# EAGLE design aiba (EAGLE 5.10)

## Sheet 1 of 7
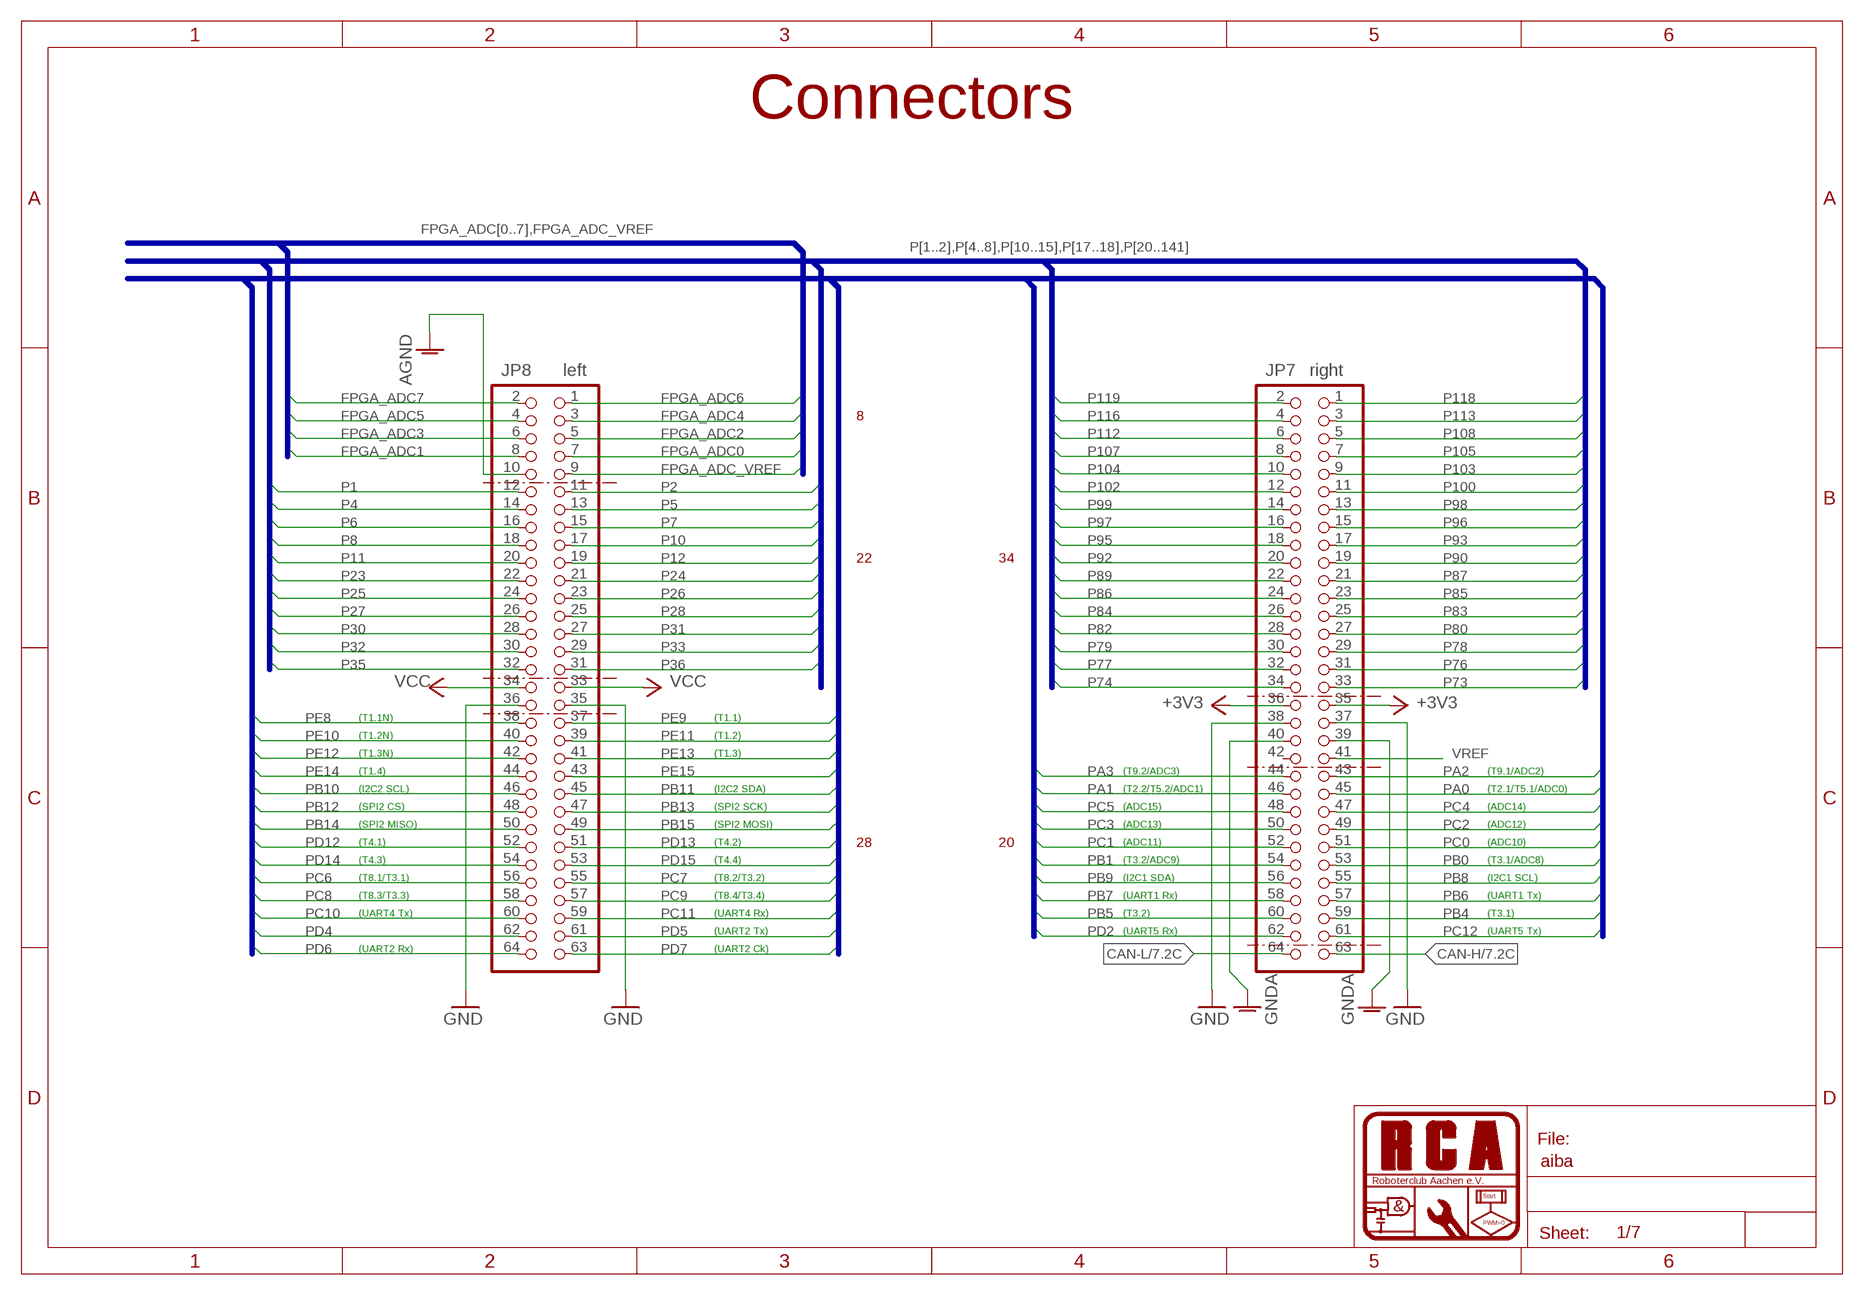
[diagram p0: schematic, sheet 1]

### Parts
JP7  right  PINHD-2X32_2.00-SMD  [2X32M_SMD]
JP8  left  PINHD-2X32_2.00-SMD  [2X32M_SMD]

### Nets
+3V3: JP7.35 JP7.36 ; also sheet 2,4,5,6,7
AGND: JP8.10
CAN-H: JP7.63 ; also sheet 7
CAN-L: JP7.64 ; also sheet 7
FPGA_ADC0: JP8.7
FPGA_ADC1: JP8.8
FPGA_ADC2: JP8.5
FPGA_ADC3: JP8.6
FPGA_ADC4: JP8.3
FPGA_ADC5: JP8.4
FPGA_ADC6: JP8.1
FPGA_ADC7: JP8.2
FPGA_ADC_VREF: JP8.9
GND: JP7.37 JP7.38 JP8.35 JP8.36 ; also sheet 2,3,4,5,6,7
GNDA: JP7.39 JP7.40 ; also sheet 6
P1: JP8.12 ; also sheet 2
P2: JP8.11 ; also sheet 2
P4: JP8.14 ; also sheet 2
P5: JP8.13 ; also sheet 2
P6: JP8.16 ; also sheet 2
P7: JP8.15 ; also sheet 2
P8: JP8.18 ; also sheet 2
P10: JP8.17 ; also sheet 2
P11: JP8.20 ; also sheet 2
P12: JP8.19 ; also sheet 2
P23: JP8.22 ; also sheet 2
P24: JP8.21 ; also sheet 2
P25: JP8.24 ; also sheet 2
P26: JP8.23 ; also sheet 2
P27: JP8.26 ; also sheet 2
P28: JP8.25 ; also sheet 2
P30: JP8.28 ; also sheet 2
P31: JP8.27 ; also sheet 2
P32: JP8.30 ; also sheet 2
P33: JP8.29 ; also sheet 2
P35: JP8.32 ; also sheet 2
P36: JP8.31 ; also sheet 2
P73: JP7.33 ; also sheet 2
P74: JP7.34 ; also sheet 2
P76: JP7.31 ; also sheet 2
P77: JP7.32 ; also sheet 2
P78: JP7.29 ; also sheet 2
P79: JP7.30 ; also sheet 2
P80: JP7.27 ; also sheet 2
P82: JP7.28 ; also sheet 2
P83: JP7.25 ; also sheet 2
P84: JP7.26 ; also sheet 2
P85: JP7.23 ; also sheet 2
P86: JP7.24 ; also sheet 2
P87: JP7.21 ; also sheet 2
P89: JP7.22 ; also sheet 2
P90: JP7.19 ; also sheet 2
P92: JP7.20 ; also sheet 2
P93: JP7.17 ; also sheet 2
P95: JP7.18 ; also sheet 2
P96: JP7.15 ; also sheet 2
P97: JP7.16 ; also sheet 2
P98: JP7.13 ; also sheet 2
P99: JP7.14 ; also sheet 2
P100: JP7.11 ; also sheet 2
P102: JP7.12 ; also sheet 2
P103: JP7.9 ; also sheet 2
P104: JP7.10 ; also sheet 2
P105: JP7.7 ; also sheet 2
P107: JP7.8 ; also sheet 2
P108: JP7.5 ; also sheet 2
P112: JP7.6 ; also sheet 2
P113: JP7.3 ; also sheet 2
P116: JP7.4 ; also sheet 2
P118: JP7.1 ; also sheet 2
P119: JP7.2 ; also sheet 2
PA0: JP7.45 ; also sheet 5
PA1: JP7.46 ; also sheet 5
PA2: JP7.43 ; also sheet 5
PA3: JP7.44 ; also sheet 5
PB0: JP7.53 ; also sheet 5
PB1: JP7.54 ; also sheet 5
PB4: JP7.59 ; also sheet 5
PB5: JP7.60 ; also sheet 5
PB6: JP7.57 ; also sheet 5
PB7: JP7.58 ; also sheet 5
PB8: JP7.55 ; also sheet 5
PB9: JP7.56 ; also sheet 5
PB10: JP8.46 ; also sheet 5
PB11: JP8.45 ; also sheet 5
PB12: JP8.48 ; also sheet 5
PB13: JP8.47 ; also sheet 5
PB14: JP8.50 ; also sheet 5
PB15: JP8.49 ; also sheet 5
PC0: JP7.51 ; also sheet 5
PC1: JP7.52 ; also sheet 5
PC2: JP7.49 ; also sheet 5
PC3: JP7.50 ; also sheet 5
PC4: JP7.47 ; also sheet 5
PC5: JP7.48 ; also sheet 5
PC6: JP8.56 ; also sheet 5
PC7: JP8.55 ; also sheet 5
PC8: JP8.58 ; also sheet 5
PC9: JP8.57 ; also sheet 5
PC10: JP8.60 ; also sheet 5
PC11: JP8.59 ; also sheet 5
PC12: JP7.61 ; also sheet 5
PD2: JP7.62 ; also sheet 5
PD4: JP8.62 ; also sheet 5
PD5: JP8.61 ; also sheet 5
PD6: JP8.64 ; also sheet 5
PD7: JP8.63 ; also sheet 5
PD12: JP8.52 ; also sheet 5
PD13: JP8.51 ; also sheet 5
PD14: JP8.54 ; also sheet 5
PD15: JP8.53 ; also sheet 5
PE8: JP8.38 ; also sheet 5
PE9: JP8.37 ; also sheet 5
PE10: JP8.40 ; also sheet 5
PE11: JP8.39 ; also sheet 5
PE12: JP8.42 ; also sheet 5
PE13: JP8.41 ; also sheet 5
PE14: JP8.44 ; also sheet 5
PE15: JP8.43 ; also sheet 5
VCC: JP8.33 JP8.34 ; also sheet 4
VREF: JP7.41 ; also sheet 6
Unconnected: JP7.42

### Buses
FPGA_ADC[0..7],FPGA_ADC_VREF
P[1..2],P[4..8],P[10..15],P[17..18],P[20..141]
PA[0..3],PA8,PB[0..2],PB[4..15],PC[0..12],PC14,FLASH_CS,PD2,SD_CS,PD[4..7],PD[12..15],PE[0..15]

### Notes on the sheet
- Connectors
- 8
- 22 | 34
- (T1.1N) | (T1.1)
- (T1.2N) | (T1.2)
- (T1.3N) | (T1.3)
- (T1.4) | (T9.2/ADC3) | (T9.1/ADC2)
- (I2C2 SCL) | (I2C2 SDA) | (T2.2/T5.2/ADC1) | (T2.1/T5.1/ADC0)
- (SPI2 CS) | (SPI2 SCK) | (ADC15) | (ADC14)
- (SPI2 MISO) | (SPI2 MOSI) | (ADC13) | (ADC12)
- (T4.1) | (T4.2) | 28 | 20 | (ADC11) | (ADC10)
- (T4.3) | (T4.4) | (T3.2/ADC9) | (T3.1/ADC8)
- (T8.1/T3.1) | (T8.2/T3.2) | (I2C1 SDA) | (I2C1 SCL)
- (T8.3/T3.3) | (T8.4/T3.4) | (UART1 Rx) | (UART1 Tx)
- (UART4 Tx) | (UART4 Rx) | (T3.2) | (T3.1)
- (UART2 Tx) | (UART5 Rx) | (UART5 Tx)
- (UART2 Rx) | (UART2 Ck)

## Sheet 2 of 7
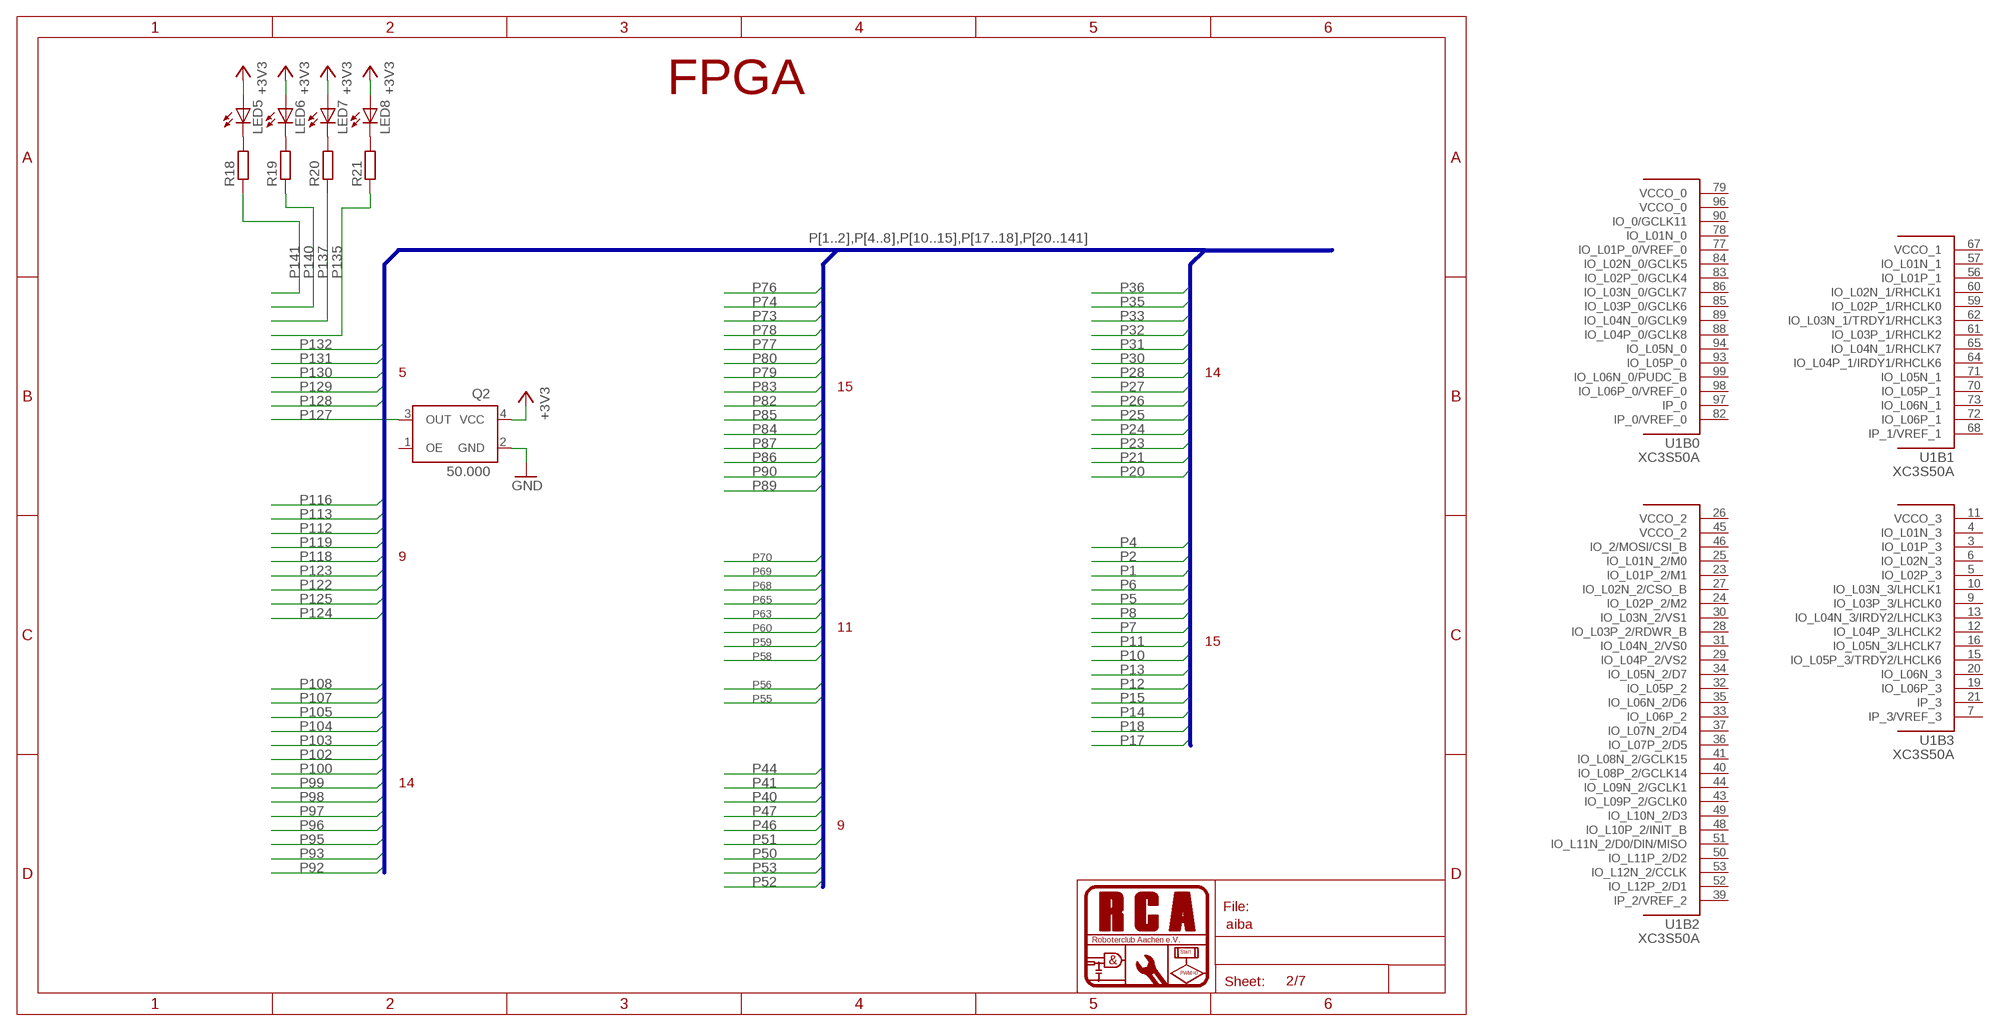
[diagram p1: schematic, sheet 2]

### Parts
LED5  LEDCHIPLED_0805  [CHIPLED_0805]
LED6  LEDCHIPLED_0805  [CHIPLED_0805]
LED7  LEDCHIPLED_0805  [CHIPLED_0805]
LED8  LEDCHIPLED_0805  [CHIPLED_0805]
Q2  50.000  XO53  [XO53]
R18  R-EU_R0805  [R0805]
R19  R-EU_R0805  [R0805]
R20  R-EU_R0805  [R0805]
R21  R-EU_R0805  [R0805]
U1  XC3S50A  XC3S50AVQ100  [VQ100]

### Nets
+3V3: LED5.A LED6.A LED7.A LED8.A Q2.4(VCC) ; also sheet 1,4,5,6,7
GND: Q2.2(GND) ; also sheet 1,3,4,5,6,7
N$22: LED8.C R21.2
N$23: LED7.C R20.2
N$24: LED6.C R19.2
N$25: LED5.C R18.2
P127: Q2.3(OUT)
P135: R21.1
P137: R20.1
P140: R19.1
P141: R18.1
Unconnected: Q2.1(OE) U1.3(B3:IO_L01P_3) U1.4(B3:IO_L01N_3) U1.5(B3:IO_L02P_3) U1.6(B3:IO_L02N_3) U1.7(B3:IP_3/VREF_3) U1.9(B3:IO_L03P_3/LHCLK0) U1.10(B3:IO_L03N_3/LHCLK1) U1.11(B3:VCCO_3) U1.12(B3:IO_L04P_3/LHCLK2) U1.13(B3:IO_L04N_3/IRDY2/LHCLK3) U1.15(B3:IO_L05P_3/TRDY2/LHCLK6) U1.16(B3:IO_L05N_3/LHCLK7) U1.19(B3:IO_L06P_3) U1.20(B3:IO_L06N_3) U1.21(B3:IP_3) U1.23(B2:IO_L01P_2/M1) U1.24(B2:IO_L02P_2/M2) U1.25(B2:IO_L01N_2/M0) U1.26(B2:VCCO_2) U1.27(B2:IO_L02N_2/CSO_B) U1.28(B2:IO_L03P_2/RDWR_B) U1.29(B2:IO_L04P_2/VS2) U1.30(B2:IO_L03N_2/VS1) U1.31(B2:IO_L04N_2/VS0) U1.32(B2:IO_L05P_2) U1.33(B2:IO_L06P_2) U1.34(B2:IO_L05N_2/D7) U1.35(B2:IO_L06N_2/D6) U1.36(B2:IO_L07P_2/D5) U1.37(B2:IO_L07N_2/D4) U1.39(B2:IP_2/VREF_2) U1.40(B2:IO_L08P_2/GCLK14) U1.41(B2:IO_L08N_2/GCLK15) U1.43(B2:IO_L09P_2/GCLK0) U1.44(B2:IO_L09N_2/GCLK1) U1.45(B2:VCCO_2) U1.46(B2:IO_2/MOSI/CSI_B) U1.48(B2:IO_L10P_2/INIT_B) U1.49(B2:IO_L10N_2/D3) U1.50(B2:IO_L11P_2/D2) U1.51(B2:IO_L11N_2/D0/DIN/MISO) U1.52(B2:IO_L12P_2/D1) U1.53(B2:IO_L12N_2/CCLK) U1.56(B1:IO_L01P_1) U1.57(B1:IO_L01N_1) U1.59(B1:IO_L02P_1/RHCLK0) U1.60(B1:IO_L02N_1/RHCLK1) U1.61(B1:IO_L03P_1/RHCLK2) U1.62(B1:IO_L03N_1/TRDY1/RHCLK3) U1.64(B1:IO_L04P_1/IRDY1/RHCLK6) U1.65(B1:IO_L04N_1/RHCLK7) U1.67(B1:VCCO_1) U1.68(B1:IP_1/VREF_1) U1.70(B1:IO_L05P_1) U1.71(B1:IO_L05N_1) U1.72(B1:IO_L06P_1) U1.73(B1:IO_L06N_1) U1.77(B0:IO_L01P_0/VREF_0) U1.78(B0:IO_L01N_0) U1.79(B0:VCCO_0) U1.82(B0:IP_0/VREF_0) U1.83(B0:IO_L02P_0/GCLK4) U1.84(B0:IO_L02N_0/GCLK5) U1.85(B0:IO_L03P_0/GCLK6) U1.86(B0:IO_L03N_0/GCLK7) U1.88(B0:IO_L04P_0/GCLK8) U1.89(B0:IO_L04N_0/GCLK9) U1.90(B0:IO_0/GCLK11) U1.93(B0:IO_L05P_0) U1.94(B0:IO_L05N_0) U1.96(B0:VCCO_0) U1.97(B0:IP_0) U1.98(B0:IO_L06P_0/VREF_0) U1.99(B0:IO_L06N_0/PUDC_B)

### Buses
P[1..2],P[4..8],P[10..15],P[17..18],P[20..141]

### Notes on the sheet
- FPGA
- 5 | 14
- 15
- 9
- 11
- 15
- 14
- 9

## Sheet 3 of 7
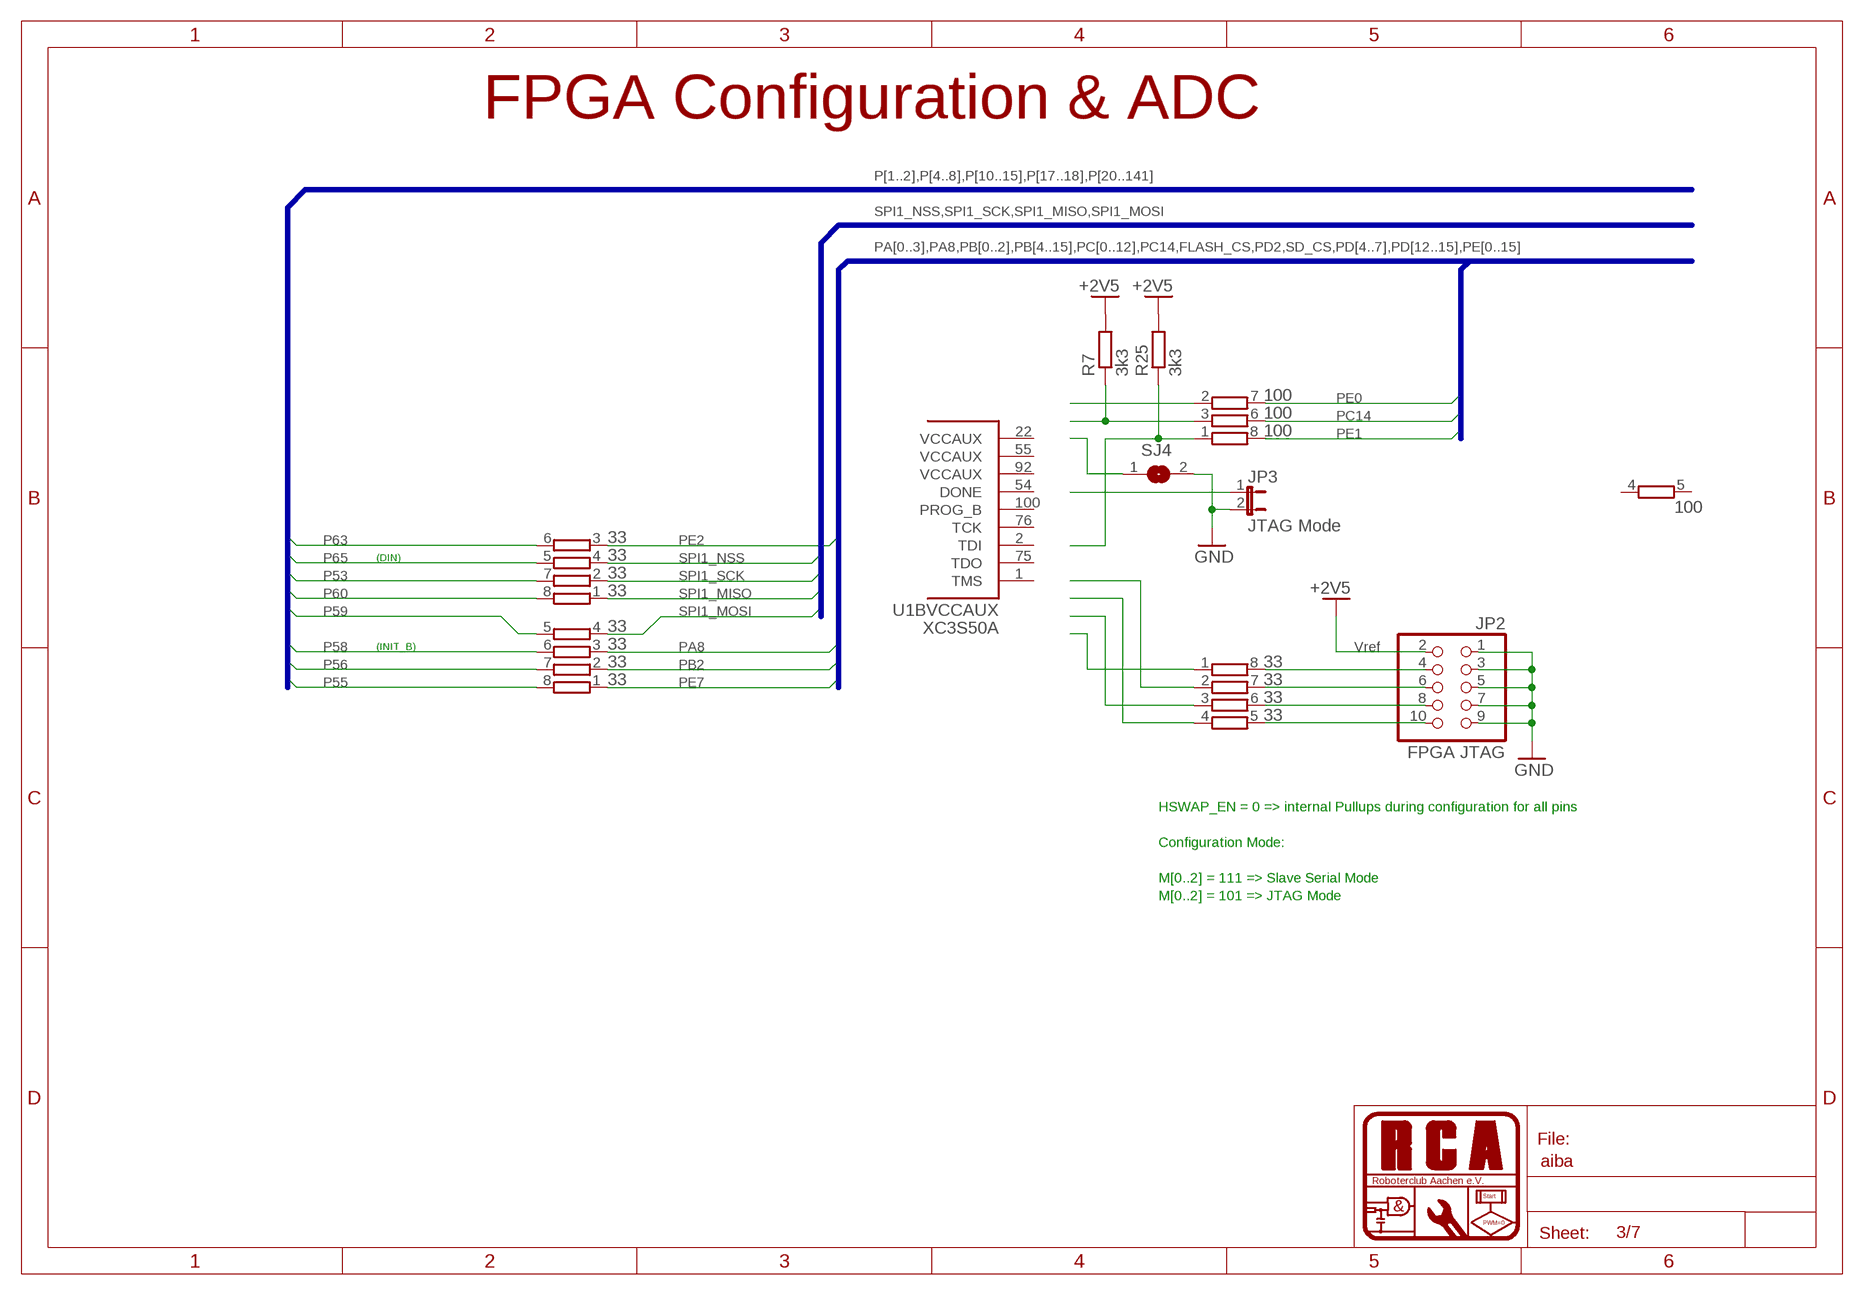
[diagram p2: schematic, sheet 3]

### Parts
JP2  FPGA JTAG  PINHD-2X5_2.54-SMD  [2X05SMD]
JP3  JTAG Mode  JP1E  [JP1]
R7  3k3  R-EU_R0805  [R0805]
R25  3k3  R-EU_R0805  [R0805]
RN1  33  4R-NEXB38V  [EXB38V]
RN2  33  4R-NEXB38V  [EXB38V]
RN3  33  4R-NEXB38V  [EXB38V]
RN4  100  4R-NEXB38V  [EXB38V]
SJ4  SJ  [SJ]

### Nets
+2V5: JP2.2 R7.2 R25.2 ; also sheet 4
GND: JP2.1 JP2.3 JP2.5 JP2.7 JP2.9 JP3.2 SJ4.2 ; also sheet 1,2,4,5,6,7
N$2: R25.1 RN4.1
N$3: R7.1 RN4.3
N$5: JP3.1
N$6: SJ4.1
N$7: RN4.2
N$8: RN3.2
N$9: RN3.4
N$10: RN3.3
N$11: RN3.1
N$12: JP2.6 RN3.7
N$13: JP2.8 RN3.6
N$14: JP2.10 RN3.5
N$15: JP2.4 RN3.8
P53: RN1.7 ; also sheet 2
P55: RN2.8 ; also sheet 2
P56: RN2.7 ; also sheet 2
P58: RN2.6 ; also sheet 2
P59: RN2.5 ; also sheet 2
P60: RN1.8 ; also sheet 2
P63: RN1.6 ; also sheet 2
P65: RN1.5 ; also sheet 2
PA8: RN2.3 ; also sheet 5
PB2: RN2.2 ; also sheet 5
PC14: RN4.6 ; also sheet 5
PE0: RN4.7 ; also sheet 5
PE1: RN4.8 ; also sheet 5
PE2: RN1.3 ; also sheet 5
PE7: RN2.1 ; also sheet 5
SPI1_MISO: RN1.1 ; also sheet 5
SPI1_MOSI: RN2.4 ; also sheet 5
SPI1_NSS: RN1.4 ; also sheet 5
SPI1_SCK: RN1.2 ; also sheet 5
Unconnected: RN4.4 RN4.5 U1.1(BVCCAUX:TMS) U1.2(BVCCAUX:TDI) U1.22(BVCCAUX:VCCAUX) U1.54(BVCCAUX:DONE) U1.55(BVCCAUX:VCCAUX) U1.75(BVCCAUX:TDO) U1.76(BVCCAUX:TCK) U1.92(BVCCAUX:VCCAUX) U1.100(BVCCAUX:PROG_B)

### Buses
P[1..2],P[4..8],P[10..15],P[17..18],P[20..141]
SPI1_NSS,SPI1_SCK,SPI1_MISO,SPI1_MOSI
PA[0..3],PA8,PB[0..2],PB[4..15],PC[0..12],PC14,FLASH_CS,PD2,SD_CS,PD[4..7],PD[12..15],PE[0..15]

### Notes on the sheet
- FPGA Configuration & ADC
- (DIN)
- (INIT_B) | Vref
- HSWAP_EN = 0 => internal Pullups during configuration for all pins
- Configuration Mode:
- M[0..2] = 111 => Slave Serial Mode
- M[0..2] = 101 => JTAG Mode

## Sheet 4 of 7
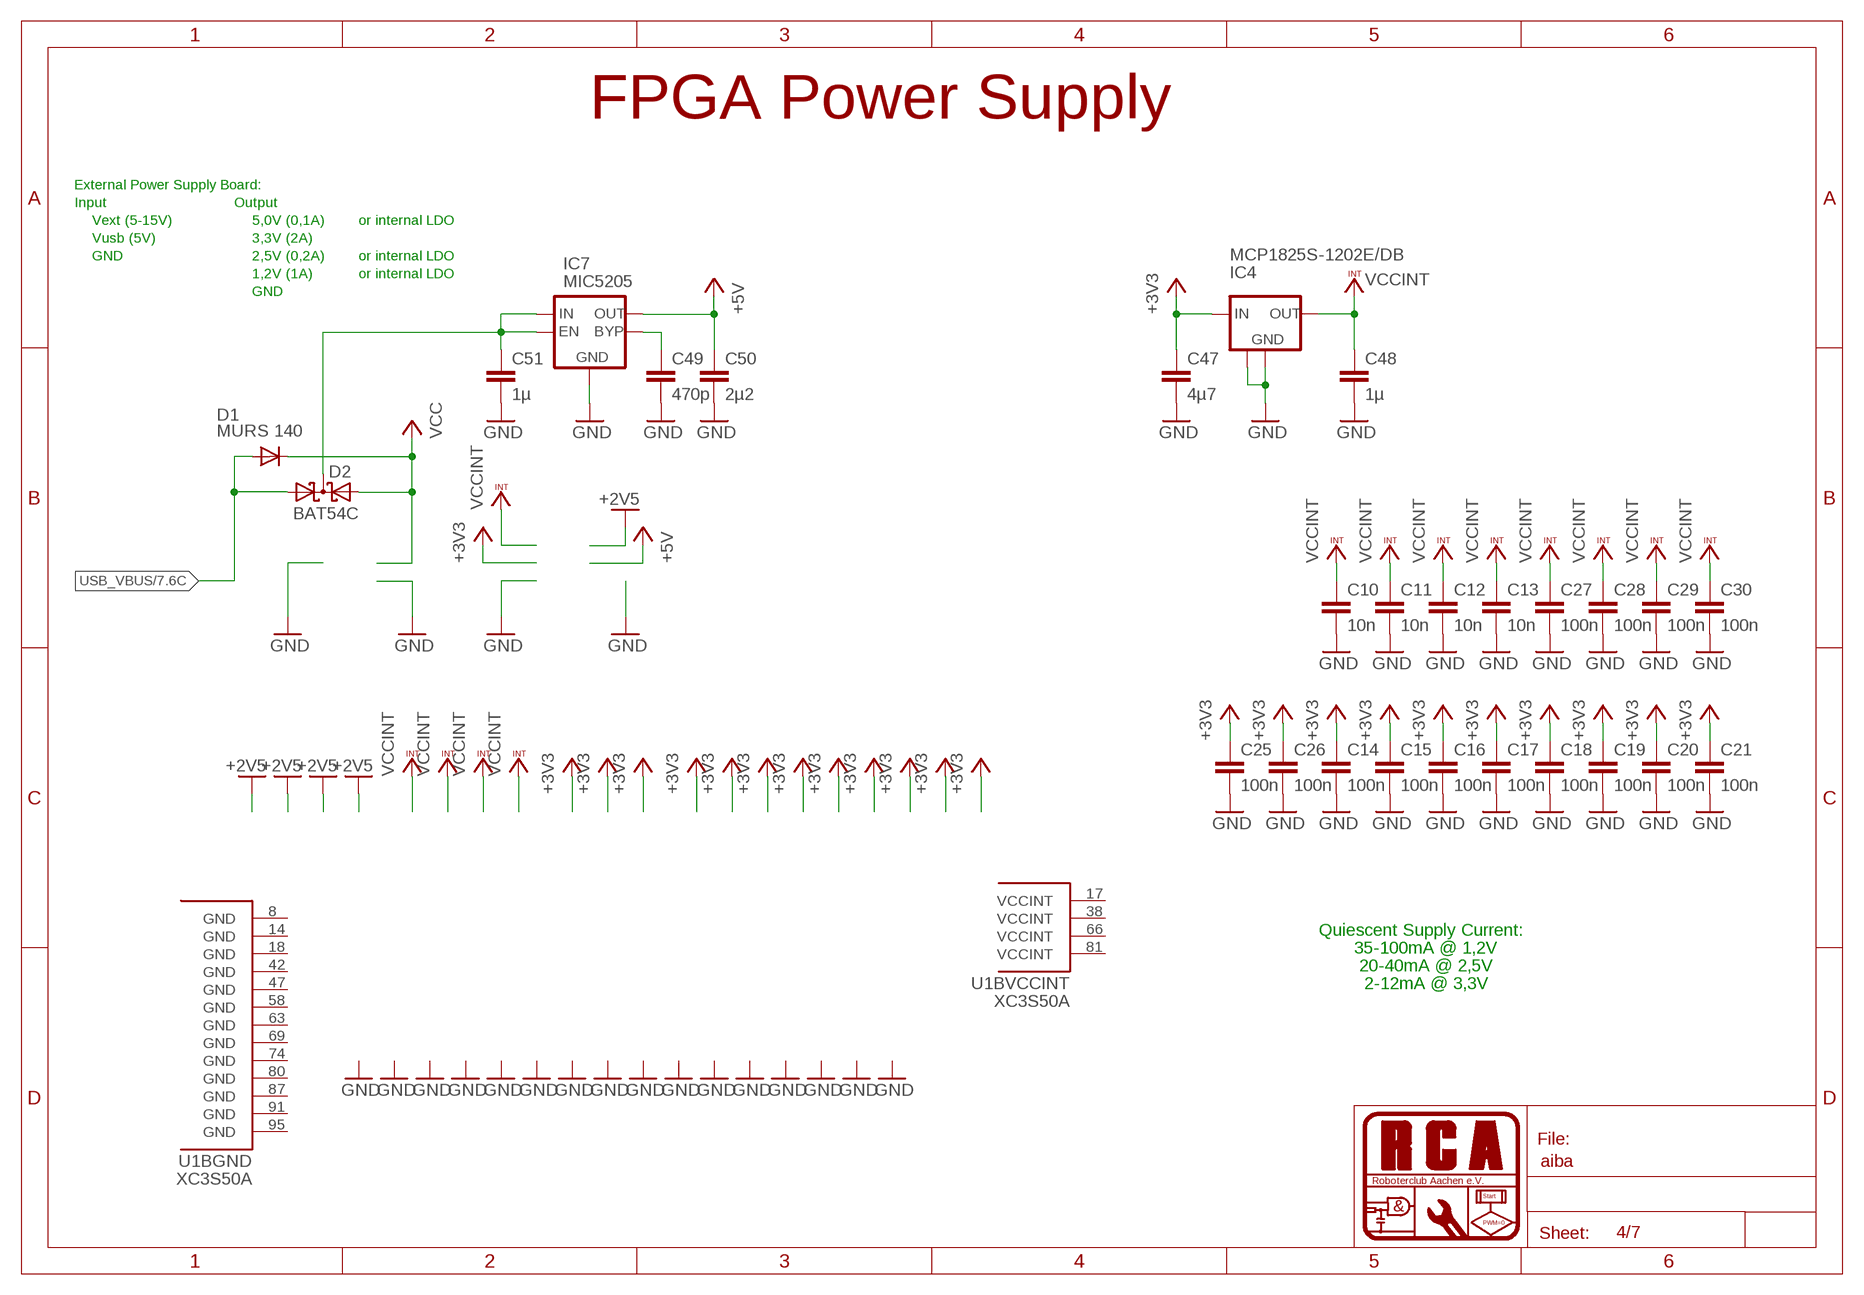
[diagram p3: schematic, sheet 4]

### Parts
C10  10n  C-EUC0603  [C0603]
C11  10n  C-EUC0603  [C0603]
C12  10n  C-EUC0603  [C0603]
C13  10n  C-EUC0603  [C0603]
C14  100n  C-EUC0603  [C0603]
C15  100n  C-EUC0603  [C0603]
C16  100n  C-EUC0603  [C0603]
C17  100n  C-EUC0603  [C0603]
C18  100n  C-EUC0603  [C0603]
C19  100n  C-EUC0603  [C0603]
C20  100n  C-EUC0603  [C0603]
C21  100n  C-EUC0603  [C0603]
C25  100n  C-EUC0603  [C0603]
C26  100n  C-EUC0603  [C0603]
C27  100n  C-EUC0603  [C0603]
C28  100n  C-EUC0603  [C0603]
C29  100n  C-EUC0603  [C0603]
C30  100n  C-EUC0603  [C0603]
C47  4µ7  C-EUC0805  [C0805]
C48  1µ  C-EUC0805  [C0805]
C49  470p  C-EUC0805  [C0805]
C50  2µ2  C-EUC0805  [C0805]
C51  1µ  C-EUC0805  [C0805]
D1  MURS 140  DIODE-SMB  [SMB]
D2  BAT54C  [SOT23]
IC4  MCP1825S-1202E/DB  MCP1825DB  [SOT223]
IC7  MIC5205  [SOT23-5L]

### Nets
+3V3: C14.1 C15.1 C16.1 C17.1 C18.1 C19.1 C20.1 C21.1 C25.1 C26.1 C47.1 IC4.1(IN) ; also sheet 1,2,5,6,7
+5V: C50.1 IC7.5(OUT) ; also sheet 7
GND: C10.2 C11.2 C12.2 C13.2 C14.2 C15.2 C16.2 C17.2 C18.2 C19.2 C20.2 C21.2 C25.2 C26.2 C27.2 C28.2 C29.2 C30.2 C47.2 C48.2 C49.2 C50.2 C51.2 IC4.2(GND) IC4.4(GND) IC7.2(GND) ; also sheet 1,2,3,5,6,7
N$40: C49.1 IC7.4(BYP)
N$43: C51.1 D2.3(CC) IC7.1(IN) IC7.3(EN)
USB_VBUS: D1.A D2.1(A1) ; also sheet 5,7
VCC: D1.C D2.2(A2) ; also sheet 1
VCCINT: C10.1 C11.1 C12.1 C13.1 C27.1 C28.1 C29.1 C30.1 C48.1 IC4.3(OUT)
Unconnected: U1.17(BVCCINT:VCCINT) U1.38(BVCCINT:VCCINT) U1.66(BVCCINT:VCCINT) U1.81(BVCCINT:VCCINT)

### Notes on the sheet
- FPGA Power Supply
- External Power Supply Board:
- Input | Output
- Vext (5-15V) | 5,0V (0,1A) | or internal LDO
- Vusb (5V) | 3,3V (2A)
- GND | 2,5V (0,2A) | or internal LDO
- 1,2V (1A) | or internal LDO
- GND
- Quiescent Supply Current:
- 35-100mA @ 1,2V
- 20-40mA @ 2,5V
- 2-12mA @ 3,3V

## Sheet 5 of 7
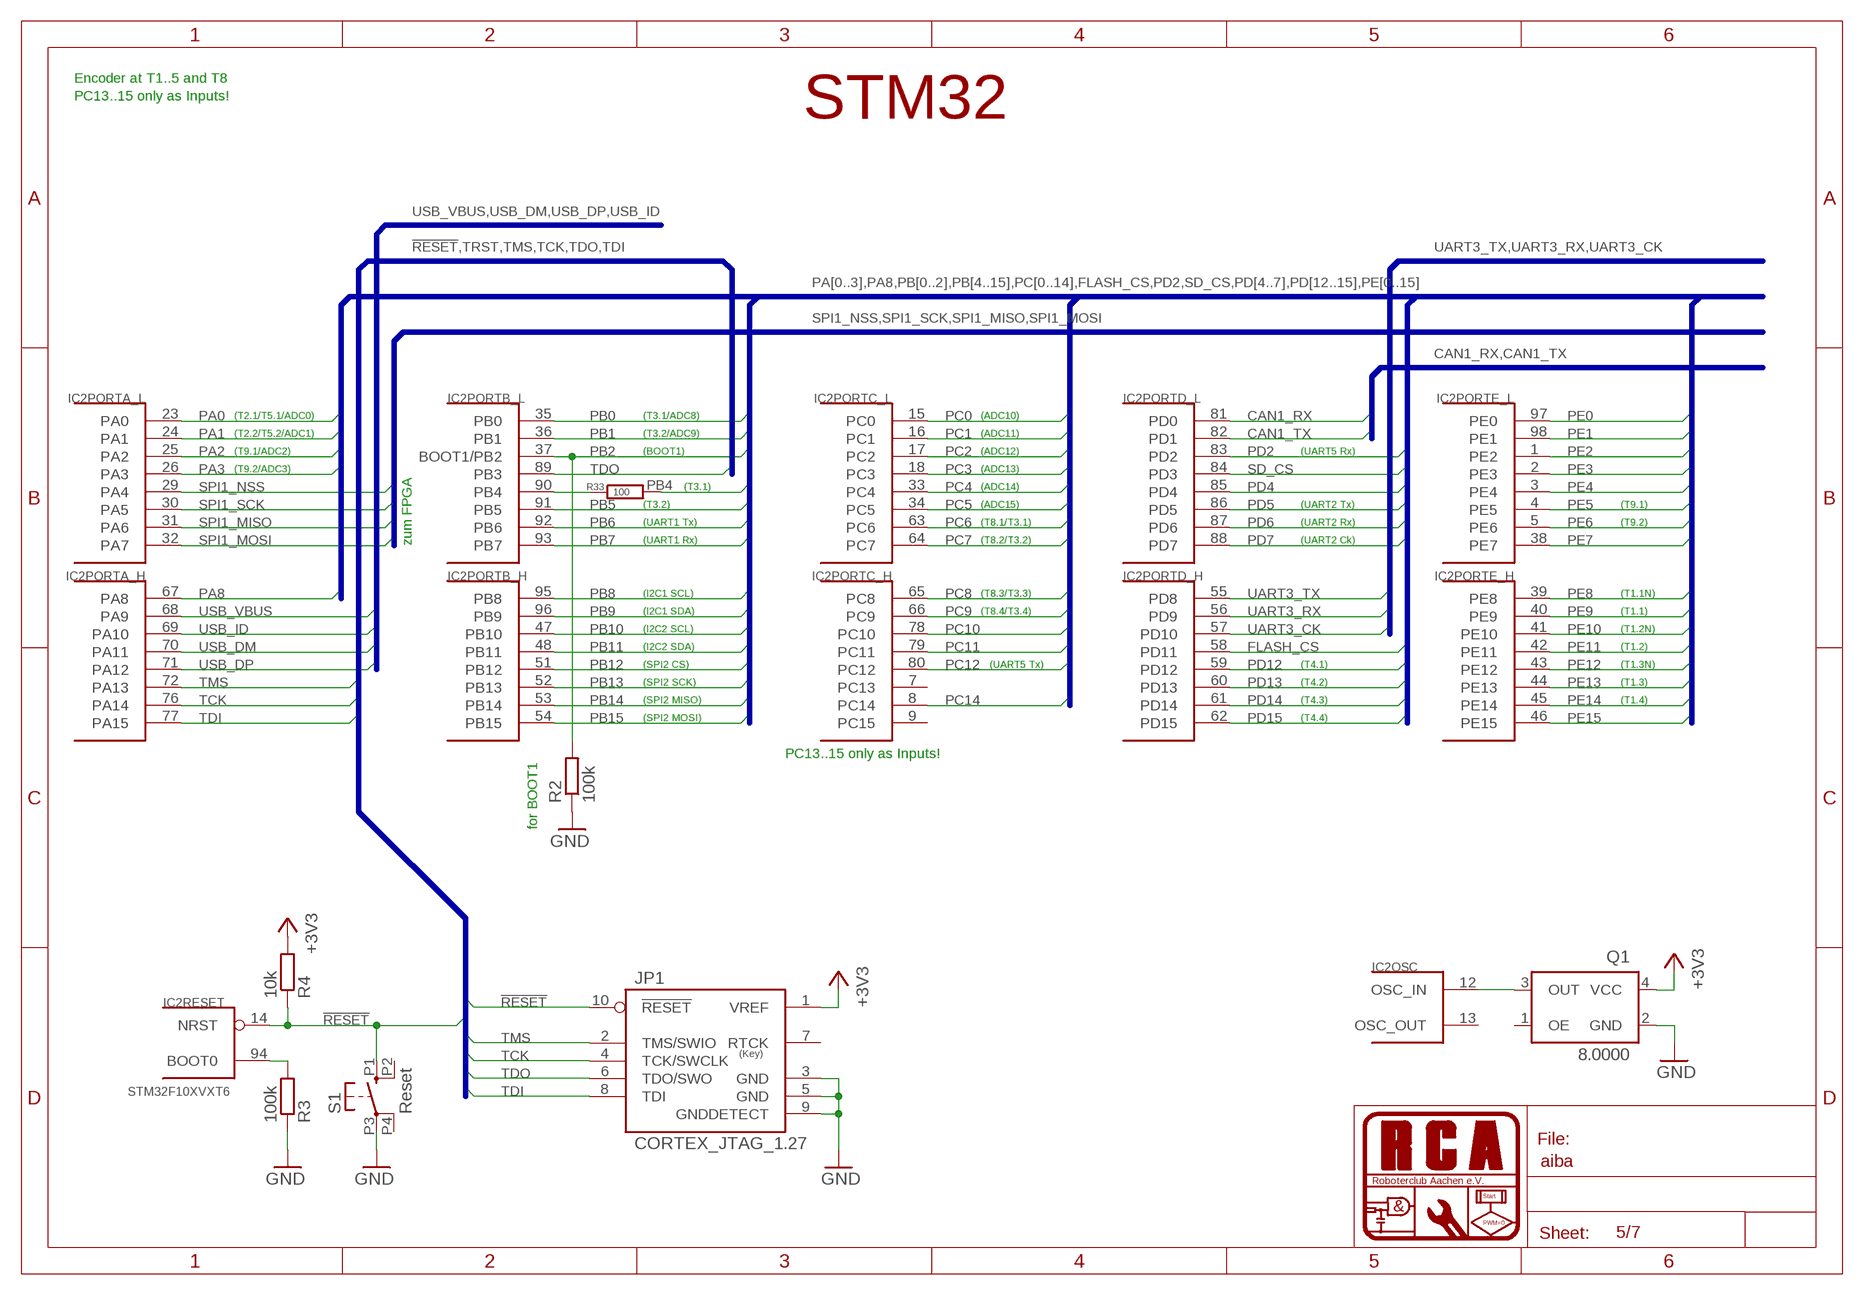
[diagram p4: schematic, sheet 5]

### Parts
IC2  STM32F10XVXT6  [TQFP100]
JP1  CORTEX_JTAG_1.27  [1365-10]
Q1  8.0000  XO53  [XO53]
R2  100k  R-EU_R0805  [R0805]
R3  100k  R-EU_R0805  [R0805]
R4  10k  R-EU_R0805  [R0805]
R33  100  R-EU_R0805  [R0805]
S1  Reset  10-XXLSH  [B3F-10XX-SMD]

### Nets
!RESET: IC2.14(RESET:NRST) JP1.10(!RESET) R4.1 S1.P1(S)
+3V3: JP1.1(VREF) Q1.4(VCC) R4.2 ; also sheet 1,2,4,6,7
CAN1_RX: IC2.81(PORTD_L:PD0) ; also sheet 7
CAN1_TX: IC2.82(PORTD_L:PD1) ; also sheet 7
FLASH_CS: IC2.58(PORTD_H:PD11) ; also sheet 7
GND: JP1.3(GND) JP1.5(GND) JP1.9(GNDDETECT) Q1.2(GND) R2.1 R3.1 S1.P3(P) ; also sheet 1,2,3,4,6,7
N$1: IC2.12(OSC:OSC_IN) Q1.3(OUT)
N$4: IC2.94(RESET:BOOT0) R3.2
N$34: IC2.90(PORTB_L:PB4) R33.1
PA0: IC2.23(PORTA_L:PA0) ; also sheet 1
PA1: IC2.24(PORTA_L:PA1) ; also sheet 1
PA2: IC2.25(PORTA_L:PA2) ; also sheet 1
PA3: IC2.26(PORTA_L:PA3) ; also sheet 1
PA8: IC2.67(PORTA_H:PA8) ; also sheet 3
PB0: IC2.35(PORTB_L:PB0) ; also sheet 1
PB1: IC2.36(PORTB_L:PB1) ; also sheet 1
PB2: IC2.37(PORTB_L:BOOT1/PB2) R2.2 ; also sheet 3
PB4: R33.2 ; also sheet 1
PB5: IC2.91(PORTB_L:PB5) ; also sheet 1
PB6: IC2.92(PORTB_L:PB6) ; also sheet 1
PB7: IC2.93(PORTB_L:PB7) ; also sheet 1
PB8: IC2.95(PORTB_H:PB8) ; also sheet 1
PB9: IC2.96(PORTB_H:PB9) ; also sheet 1
PB10: IC2.47(PORTB_H:PB10) ; also sheet 1
PB11: IC2.48(PORTB_H:PB11) ; also sheet 1
PB12: IC2.51(PORTB_H:PB12) ; also sheet 1
PB13: IC2.52(PORTB_H:PB13) ; also sheet 1
PB14: IC2.53(PORTB_H:PB14) ; also sheet 1
PB15: IC2.54(PORTB_H:PB15) ; also sheet 1
PC0: IC2.15(PORTC_L:PC0) ; also sheet 1
PC1: IC2.16(PORTC_L:PC1) ; also sheet 1
PC2: IC2.17(PORTC_L:PC2) ; also sheet 1
PC3: IC2.18(PORTC_L:PC3) ; also sheet 1
PC4: IC2.33(PORTC_L:PC4) ; also sheet 1
PC5: IC2.34(PORTC_L:PC5) ; also sheet 1
PC6: IC2.63(PORTC_L:PC6) ; also sheet 1
PC7: IC2.64(PORTC_L:PC7) ; also sheet 1
PC8: IC2.65(PORTC_H:PC8) ; also sheet 1
PC9: IC2.66(PORTC_H:PC9) ; also sheet 1
PC10: IC2.78(PORTC_H:PC10) ; also sheet 1
PC11: IC2.79(PORTC_H:PC11) ; also sheet 1
PC12: IC2.80(PORTC_H:PC12) ; also sheet 1
PC14: IC2.8(PORTC_H:PC14) ; also sheet 3
PD2: IC2.83(PORTD_L:PD2) ; also sheet 1
PD4: IC2.85(PORTD_L:PD4) ; also sheet 1
PD5: IC2.86(PORTD_L:PD5) ; also sheet 1
PD6: IC2.87(PORTD_L:PD6) ; also sheet 1
PD7: IC2.88(PORTD_L:PD7) ; also sheet 1
PD12: IC2.59(PORTD_H:PD12) ; also sheet 1
PD13: IC2.60(PORTD_H:PD13) ; also sheet 1
PD14: IC2.61(PORTD_H:PD14) ; also sheet 1
PD15: IC2.62(PORTD_H:PD15) ; also sheet 1
PE0: IC2.97(PORTE_L:PE0) ; also sheet 3
PE1: IC2.98(PORTE_L:PE1) ; also sheet 3
PE2: IC2.1(PORTE_L:PE2) ; also sheet 3
PE3: IC2.2(PORTE_L:PE3) ; also sheet 7
PE4: IC2.3(PORTE_L:PE4) ; also sheet 7
PE5: IC2.4(PORTE_L:PE5) ; also sheet 7
PE6: IC2.5(PORTE_L:PE6) ; also sheet 7
PE7: IC2.38(PORTE_L:PE7) ; also sheet 3
PE8: IC2.39(PORTE_H:PE8) ; also sheet 1
PE9: IC2.40(PORTE_H:PE9) ; also sheet 1
PE10: IC2.41(PORTE_H:PE10) ; also sheet 1
PE11: IC2.42(PORTE_H:PE11) ; also sheet 1
PE12: IC2.43(PORTE_H:PE12) ; also sheet 1
PE13: IC2.44(PORTE_H:PE13) ; also sheet 1
PE14: IC2.45(PORTE_H:PE14) ; also sheet 1
PE15: IC2.46(PORTE_H:PE15) ; also sheet 1
SD_CS: IC2.84(PORTD_L:PD3)
SPI1_MISO: IC2.31(PORTA_L:PA6) ; also sheet 3
SPI1_MOSI: IC2.32(PORTA_L:PA7) ; also sheet 3
SPI1_NSS: IC2.29(PORTA_L:PA4) ; also sheet 3
SPI1_SCK: IC2.30(PORTA_L:PA5) ; also sheet 3
TCK: IC2.76(PORTA_H:PA14) JP1.4(TCK/SWCLK)
TDI: IC2.77(PORTA_H:PA15) JP1.8(TDI)
TDO: IC2.89(PORTB_L:PB3) JP1.6(TDO/SWO)
TMS: IC2.72(PORTA_H:PA13) JP1.2(TMS/SWIO)
UART3_CK: IC2.57(PORTD_H:PD10) ; also sheet 7
UART3_RX: IC2.56(PORTD_H:PD9) ; also sheet 7
UART3_TX: IC2.55(PORTD_H:PD8) ; also sheet 7
USB_DM: IC2.70(PORTA_H:PA11) ; also sheet 7
USB_DP: IC2.71(PORTA_H:PA12) ; also sheet 7
USB_ID: IC2.69(PORTA_H:PA10) ; also sheet 7
USB_VBUS: IC2.68(PORTA_H:PA9) ; also sheet 4,7
Unconnected: IC2.7(PORTC_H:PC13) IC2.9(PORTC_H:PC15) IC2.13(OSC:OSC_OUT) JP1.7(RTCK) Q1.1(OE) S1.P2(S1) S1.P4(P1)

### Buses
!RESET,TRST,TMS,TCK,TDO,TDI
USB_VBUS,USB_DM,USB_DP,USB_ID
SPI1_NSS,SPI1_SCK,SPI1_MISO,SPI1_MOSI
CAN1_RX,CAN1_TX
PA[0..3],PA8,PB[0..2],PB[4..15],PC[0..14],FLASH_CS,PD2,SD_CS,PD[4..7],PD[12..15],PE[0..15]
UART3_TX,UART3_RX,UART3_CK

### Notes on the sheet
- Encoder at T1..5 and T8
- PC13..15 only as Inputs!
- STM32
- (T2.1/T5.1/ADC0) | (T3.1/ADC8) | (ADC10)
- (T2.2/T5.2/ADC1) | (T3.2/ADC9) | (ADC11)
- (T9.1/ADC2) | (BOOT1) | (ADC12) | (UART5 Rx)
- (T9.2/ADC3) | (ADC13)
- (T3.1) | (ADC14)
- (T3.2) | (ADC15) | (UART2 Tx) | (T9.1)
- (UART1 Tx) | (T8.1/T3.1) | (UART2 Rx) | (T9.2)
- zum FPGA | (UART1 Rx) | (T8.2/T3.2) | (UART2 Ck)
- (I2C1 SCL) | (T8.3/T3.3) | (T1.1N)
- (I2C1 SDA) | (T8.4/T3.4) | (T1.1)
- (I2C2 SCL) | (T1.2N)
- (I2C2 SDA) | (T1.2)
- (SPI2 CS) | (UART5 Tx) | (T4.1) | (T1.3N)
- (SPI2 SCK) | (T4.2) | (T1.3)
- (SPI2 MISO) | (T4.3) | (T1.4)
- (SPI2 MOSI) | (T4.4)
- PC13..15 only as Inputs!
- for BOOT1

## Sheet 6 of 7
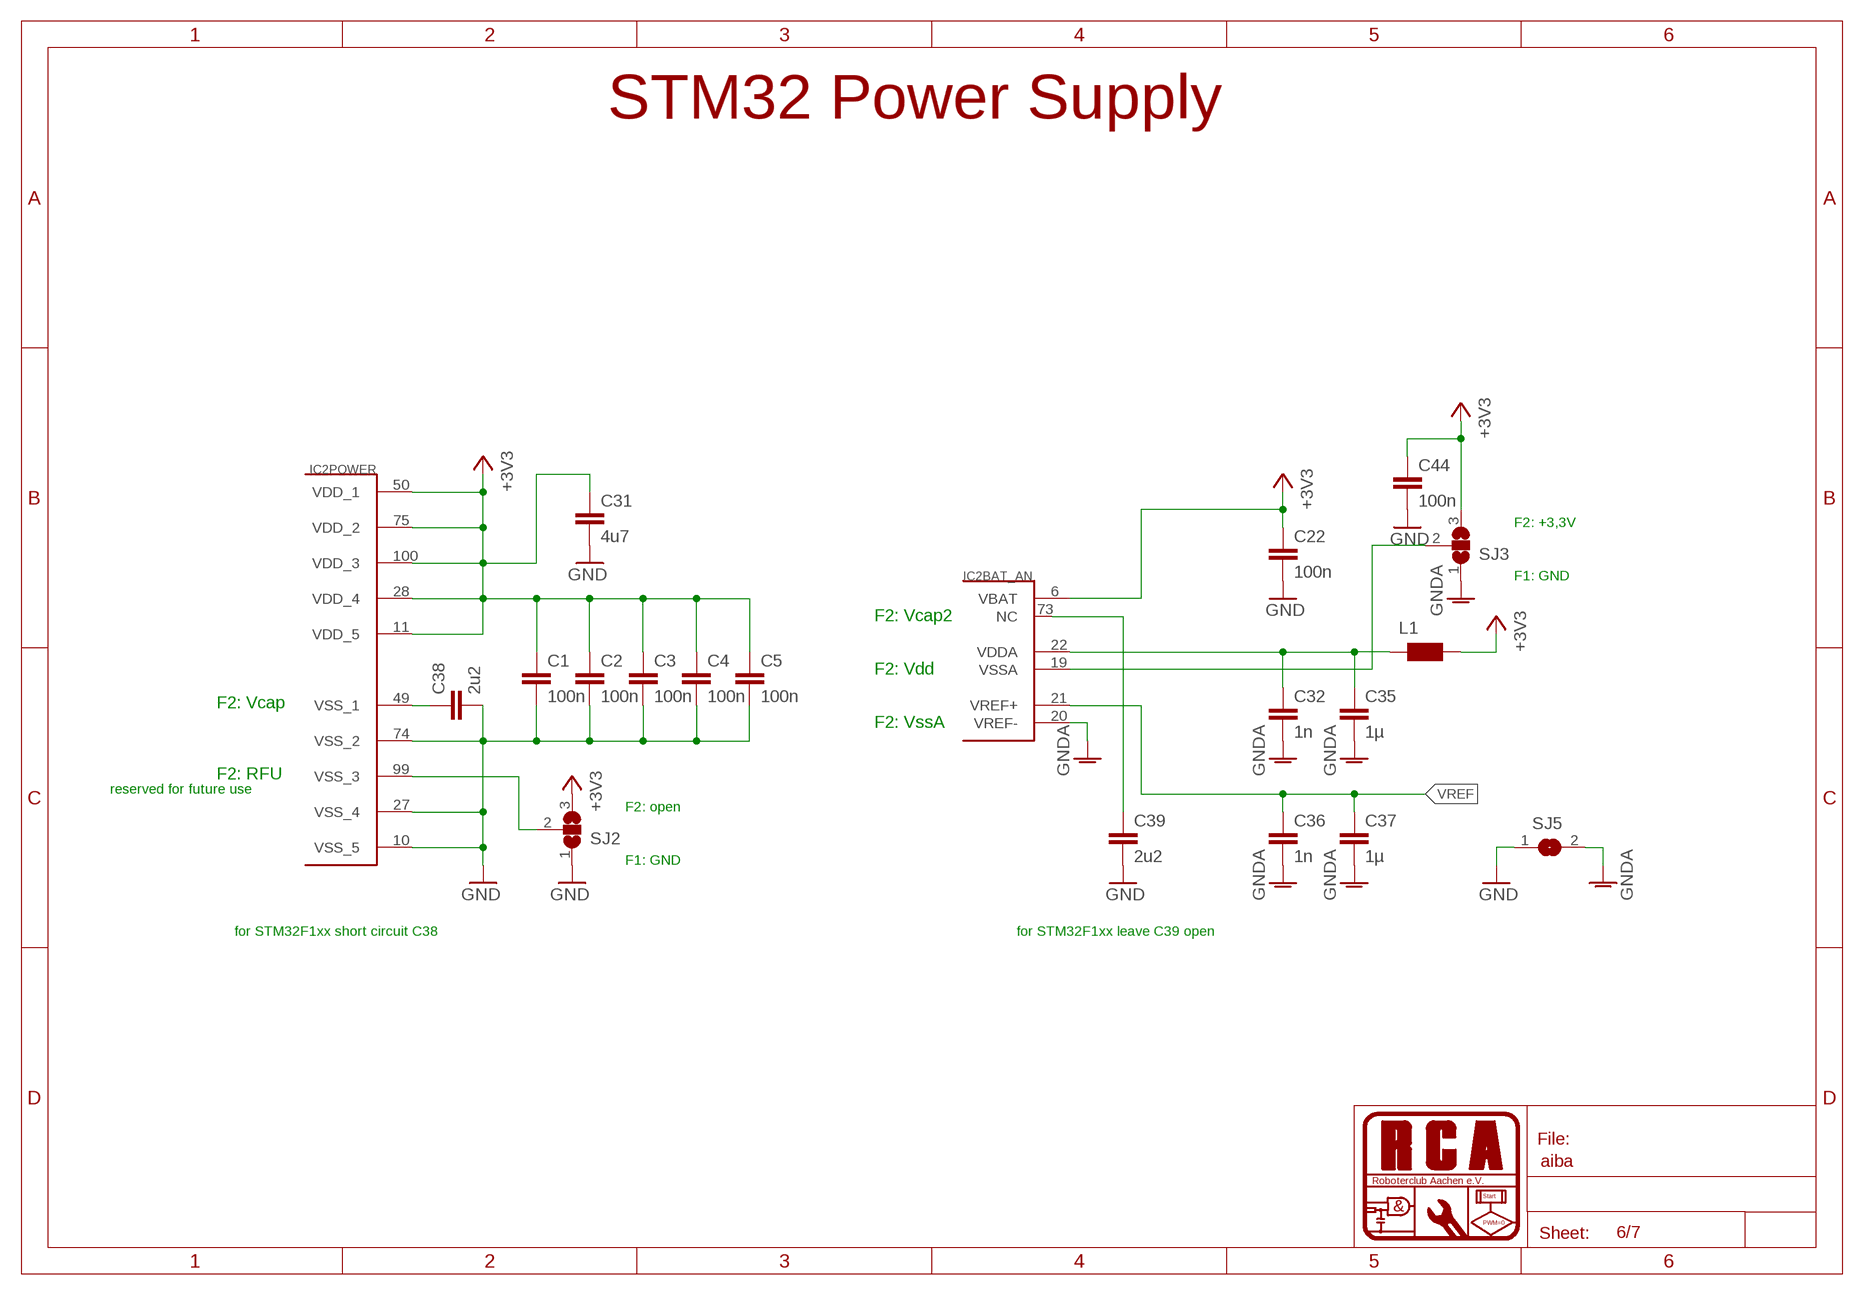
[diagram p5: schematic, sheet 6]

### Parts
C1  100n  C-EUC0603  [C0603]
C2  100n  C-EUC0603  [C0603]
C3  100n  C-EUC0603  [C0603]
C4  100n  C-EUC0603  [C0603]
C5  100n  C-EUC0603  [C0603]
C22  100n  C-EUC0603  [C0603]
C31  4u7  C-EUC0805  [C0805]
C32  1n  C-EUC0603  [C0603]
C35  1µ  C-EUC0805  [C0805]
C36  1n  C-EUC0603  [C0603]
C37  1µ  C-EUC0805  [C0805]
C38  2u2  C-EUC0805  [C0805]
C39  2u2  C-EUC0805  [C0805]
C44  100n  C-EUC0603  [C0603]
L1  WE-KIHQ_0805  [WE-KI_0805_B]
SJ2  SJ2WS  [SJ_2S]
SJ3  SJ2WS  [SJ_2S]
SJ5  SJS  [SJS]

### Nets
+3V3: C1.1 C2.1 C3.1 C4.1 C5.1 C22.1 C31.1 C44.1 IC2.6(BAT_AN:VBAT) IC2.11(POWER:VDD_5) IC2.28(POWER:VDD_4) IC2.50(POWER:VDD_1) IC2.75(POWER:VDD_2) IC2.100(POWER:VDD_3) L1.1 SJ2.3 SJ3.3 ; also sheet 1,2,4,5,7
GND: C1.2 C2.2 C3.2 C4.2 C5.2 C22.2 C31.2 C38.2 C39.2 C44.2 IC2.10(POWER:VSS_5) IC2.27(POWER:VSS_4) IC2.74(POWER:VSS_2) SJ2.1 SJ5.1 ; also sheet 1,2,3,4,5,7
GNDA: C32.2 C35.2 C36.2 C37.2 IC2.20(BAT_AN:VREF-) SJ3.1 SJ5.2 ; also sheet 1
N$27: C38.1 IC2.49(POWER:VSS_1)
N$28: IC2.99(POWER:VSS_3) SJ2.2
N$29: C39.1 IC2.73(BAT_AN:NC)
N$30: IC2.19(BAT_AN:VSSA) SJ3.2
N$36: C32.1 C35.1 IC2.22(BAT_AN:VDDA) L1.2
VREF: C36.1 C37.1 IC2.21(BAT_AN:VREF+) ; also sheet 1

### Notes on the sheet
- STM32 Power Supply
- F2: +3,3V
- F1: GND
- F2: Vcap2
- F2: Vdd
- F2: Vcap
- F2: VssA
- F2: RFU
- reserved for future use
- F2: open
- F1: GND
- for STM32F1xx short circuit C38 | for STM32F1xx leave C39 open

## Sheet 7 of 7
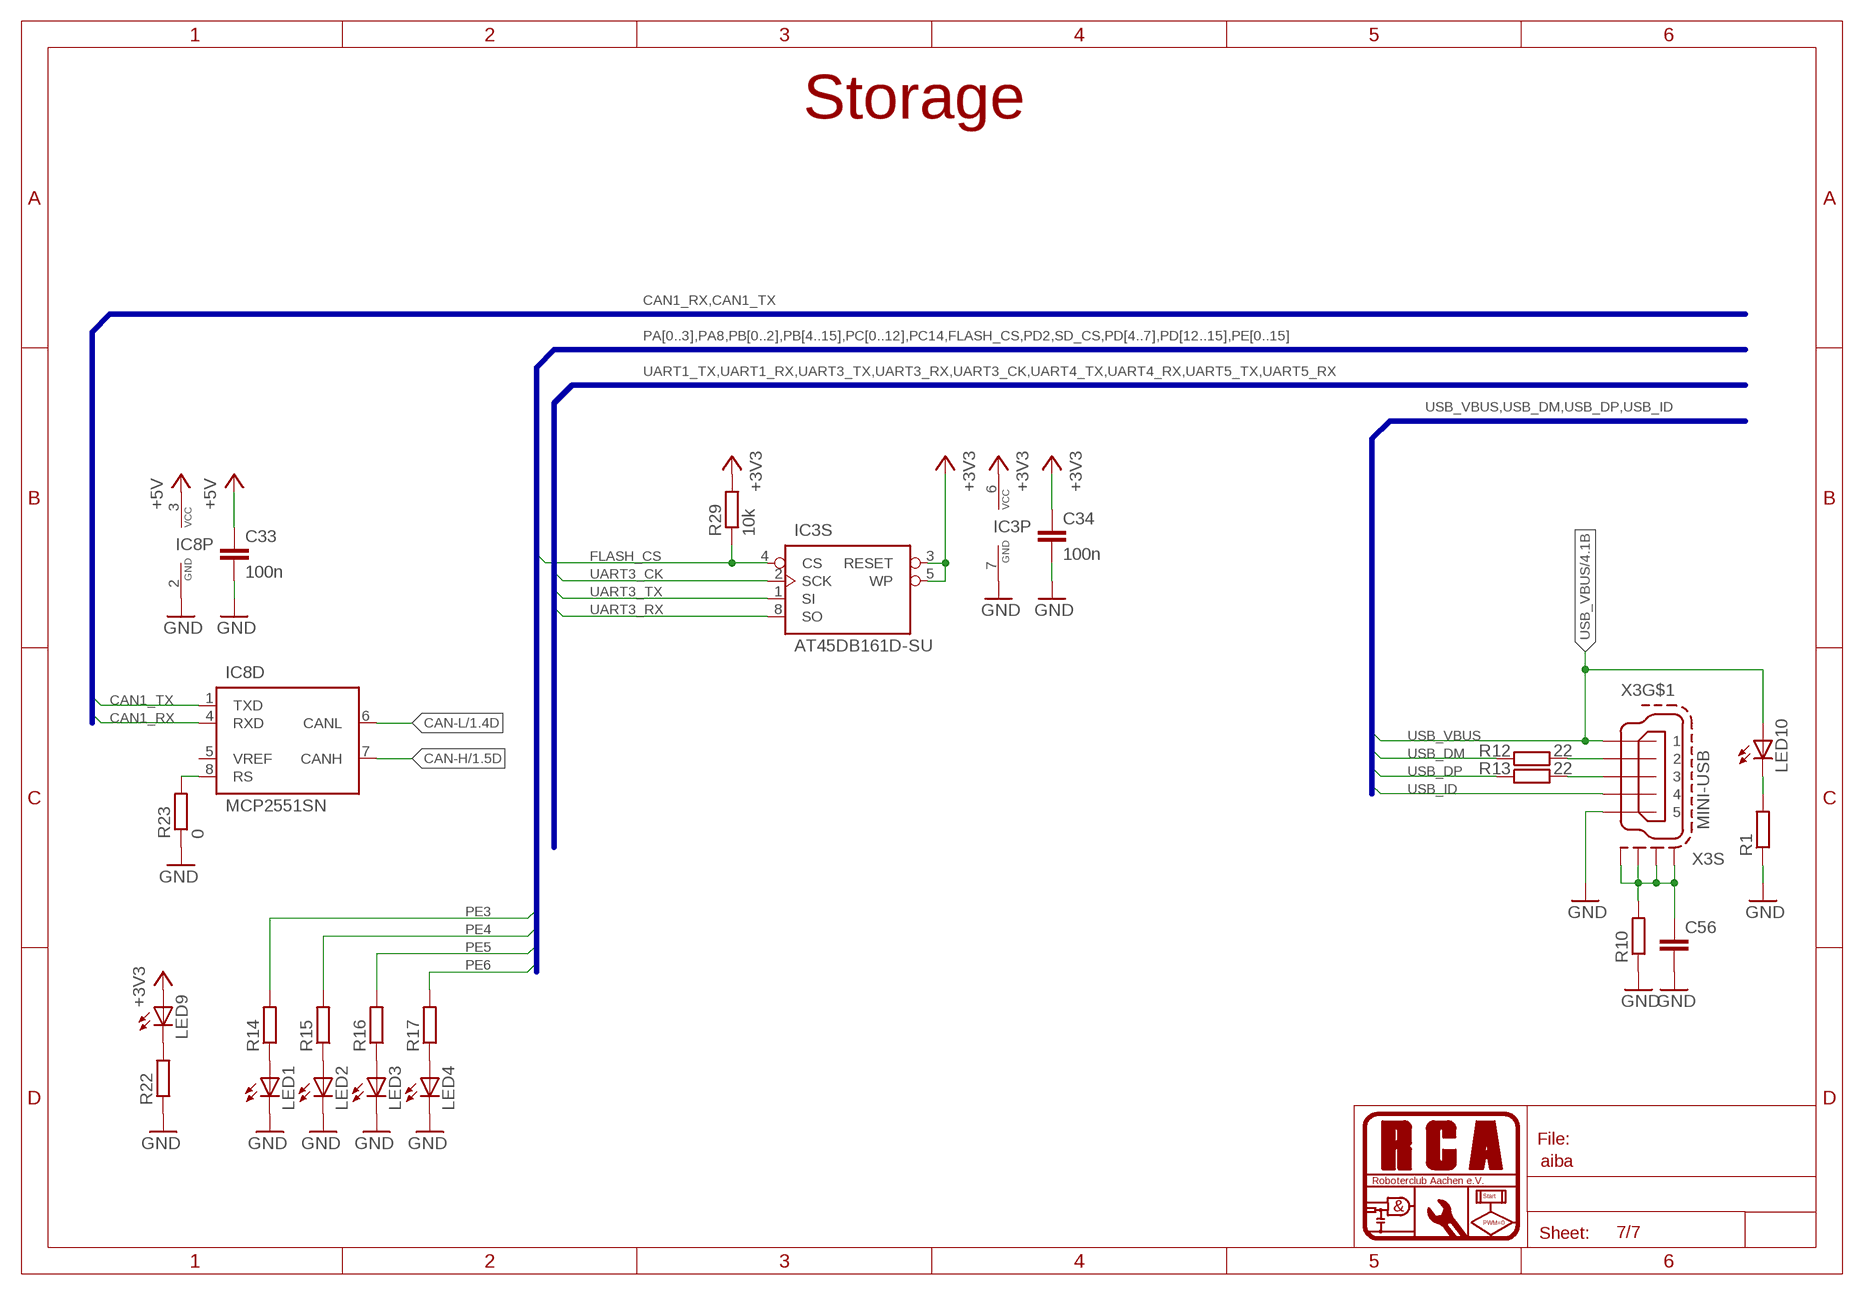
[diagram p6: schematic, sheet 7]

### Parts
C33  100n  C-EUC0603  [C0603]
C34  100n  C-EUC0805  [C0805]
C56  C-EUC0603  [C0603]
IC3  AT45DB161D-SU  AT45DB041DS  [SO-08M]
IC8  MCP2551SN  [SOIC-8]
LED1  LEDCHIPLED_0805  [CHIPLED_0805]
LED2  LEDCHIPLED_0805  [CHIPLED_0805]
LED3  LEDCHIPLED_0805  [CHIPLED_0805]
LED4  LEDCHIPLED_0805  [CHIPLED_0805]
LED9  LEDCHIPLED_0805  [CHIPLED_0805]
LED10  LEDCHIPLED_0805  [CHIPLED_0805]
R1  R-EU_R0805  [R0805]
R10  R-EU_R0805  [R0805]
R12  22  R-EU_R0805  [R0805]
R13  22  R-EU_R0805  [R0805]
R14  R-EU_R0805  [R0805]
R15  R-EU_R0805  [R0805]
R16  R-EU_R0805  [R0805]
R17  R-EU_R0805  [R0805]
R22  R-EU_R0805  [R0805]
R23  0  R-EU_R0805  [R0805]
R29  10k  R-EU_M0805  [M0805]
X3  MINI-USB  MINI-USB-SCHIELD-32005-201  [32005-201]

### Nets
+3V3: C34.1 IC3.3(S:RESET) IC3.5(S:WP) IC3.6(P:VCC) LED9.A R29.2 ; also sheet 1,2,4,5,6
+5V: C33.1 IC8.3(P:VCC) ; also sheet 4
CAN1_RX: IC8.4(D:RXD) ; also sheet 5
CAN1_TX: IC8.1(D:TXD) ; also sheet 5
CAN-H: IC8.7(D:CANH) ; also sheet 1
CAN-L: IC8.6(D:CANL) ; also sheet 1
FLASH_CS: IC3.4(S:CS) R29.1 ; also sheet 5
GND: C33.2 C34.2 C56.2 IC3.7(P:GND) IC8.2(P:GND) LED1.C LED2.C LED3.C LED4.C R1.1 R10.1 R22.1 R23.1 X3.5 ; also sheet 1,2,3,4,5,6
N$16: R12.2 X3.2
N$17: R13.2 X3.3
N$18: LED1.A R14.1
N$19: LED2.A R15.1
N$20: LED3.A R16.1
N$21: LED4.A R17.1
N$26: LED9.C R22.2
N$31: IC8.8(D:RS) R23.2
N$33: LED10.C R1.2
N$42: C56.1 R10.2 X3.M1(S:S1) X3.M2(S:S2) X3.M3(S:S3) X3.M4(S:S4)
PE3: R14.2 ; also sheet 5
PE4: R15.2 ; also sheet 5
PE5: R16.2 ; also sheet 5
PE6: R17.2 ; also sheet 5
UART3_CK: IC3.2(S:SCK) ; also sheet 5
UART3_RX: IC3.8(S:SO) ; also sheet 5
UART3_TX: IC3.1(S:SI) ; also sheet 5
USB_DM: R12.1 ; also sheet 5
USB_DP: R13.1 ; also sheet 5
USB_ID: X3.4 ; also sheet 5
USB_VBUS: LED10.A X3.1 ; also sheet 4,5
Unconnected: IC8.5(D:VREF)

### Buses
USB_VBUS,USB_DM,USB_DP,USB_ID
CAN1_RX,CAN1_TX
UART1_TX,UART1_RX,UART3_TX,UART3_RX,UART3_CK,UART4_TX,UART4_RX,UART5_TX,UART5_RX
PA[0..3],PA8,PB[0..2],PB[4..15],PC[0..12],PC14,FLASH_CS,PD2,SD_CS,PD[4..7],PD[12..15],PE[0..15]

### Notes on the sheet
- Storage

## Power pins joined to a net without a drawn wire
GND: U1.8(BGND:GND) U1.14(BGND:GND) U1.18(BGND:GND) U1.42(BGND:GND) U1.47(BGND:GND) U1.58(BGND:GND) U1.63(BGND:GND) U1.69(BGND:GND) U1.74(BGND:GND) U1.80(BGND:GND) U1.87(BGND:GND) U1.91(BGND:GND) U1.95(BGND:GND)

## Library data of the parts
C1-C5 C10-C22 C25-C39 C44 C47-C51 C56 = rcl:C-EU: CAPACITOR, European symbol
D1 = diode:DIODE-: DIODE
D2 = diode:BAT54C: Schottky Diodes Source: Fairchild .. BAT54.pdf
IC2 = stm32:STM32F10XVXT6: STM32F101/103 100 pin LQFP
IC3 = rca_ic:AT45DB: AT45DBxxxD Single 2.5V or 2.7V to 3.6V Supply Serial Interface: 66 MHz Maximum Clock Frequency AT45DB041D: 4,325,376 bits of memory as 2,048 pages of 256 bytes
IC4 = rca_spgversorgung:MCP182*
IC7 = rca_spgversorgung:MIC5205: MIC5205 150mA Low-Noise LDO Regulator The MIC5205 is an efficient linear voltage regulator with ultra low-noise output, very low dropout voltage (typically 17mV at light loads and 165mV at 150mA), and very low ground current (600µA at 100mA output). The MIC5205 offers better than 1% initial accuracy.
IC8 = rca_ic:MCP2551: High-Speed CAN Transceiver
JP1 = rca_stecker:CORTEX_JTAG
JP2 = pinhead2:PINHD-2X5: PIN HEADER
JP3 = jumper:JP1E: JUMPER
JP7 JP8 = pinhead2:PINHD-2X32
L1 = wuerth-elektronik:WE-KIHQ: SMD Wire Wound Ceramic Inductor WE-KIHQ - High current - Highest Quality factor in size 0805 - up to 98 - High thermal stability - High SRF -- Bluetooth -- Wireless LAN -- RF oscillation circuit -- IF impedance matching -- IG choke
LED1-LED10 = led:LED: LED OSRAM: - CHIPLED LG R971, LG N971, LY N971, LG Q971, LY Q971, LO R971, LY R971 LH N974, LH R974 LS Q976, LO Q976, LY Q976 LO Q996 - Hyper CHIPLED LW Q18S LB Q993, LB Q99A, LB R99A - SideLED LS A670, LO A670, LY A670, LG A670, LP A670 LB A673, LV A673, LT A673, LW A673 LH A674 LY A675 LS A676, LA A676, LO A676, LY A676, LW A676 LS A679, LY A679, LG A679 - Hyper Micro SIDELED® LS Y876, LA Y876, LO Y876, LY Y876 LT Y87S - SmartLED LW L88C, LW L88S LB L89C, LB L89S, LG L890 LS L89K, LO L89K, LY L89K LS L896, LA L896, LO L896, LY L896 - TOPLED LS T670, LO T670, LY T670, LG T670, LP T670 LSG T670, LSP T670, LSY T670, LOP T670, LYG T670 LG T671, LOG T671, LSG T671 LB T673, LV T673, LT T673, LW T673 LH T674 LS T676, LA T676, LO T676, LY T676, LB T676, LH T676, LSB T676, LW T676 LB T67C, LV T67C, LT T67C, LS T67K, LO T67K, LY T67K, LW E67C LS E67B, LA E67B, LO E67B, LY E67B, LB E67C, LV E67C, LT E67C LW T67C LS T679, LY T679, LG T679 LS T770, LO T770, LY T770, LG T770, LP T770 LB T773, LV T773, LT T773, LW T773 LH T774 LS E675, LA E675, LY E675, LS T675 LS T776, LA T776, LO T776, LY T776, LB T776 LHGB T686 LT T68C, LB T68C - Hyper Mini TOPLED® LB M676 - Mini TOPLED Santana® LG M470 LS M47K, LO M47K, LY M47K Source: http://www.osram.convergy.de LUXEON: - LUMILED® LXK2-PW12-R00, LXK2-PW12-S00, LXK2-PW14-U00, LXK2-PW14-V00 LXK2-PM12-R00, LXK2-PM12-S00, LXK2-PM14-U00 LXK2-PE12-Q00, LXK2-PE12-R00, LXK2-PE12-S00, LXK2-PE14-T00, LXK2-PE14-U00 LXK2-PB12-K00, LXK2-PB12-L00, LXK2-PB12-M00, LXK2-PB14-N00, LXK2-PB14-P00, LXK2-PB14-Q00 LXK2-PR12-L00, LXK2-PR12-M00, LXK2-PR14-Q00, LXK2-PR14-R00 LXK2-PD12-Q00, LXK2-PD12-R00, LXK2-PD12-S00 LXK2-PH12-R00, LXK2-PH12-S00 LXK2-PL12-P00, LXK2-PL12-Q00, LXK2-PL12-R00 Source: www.luxeon.com KINGBRIGHT: KA-3528ASYC Source: www.kingbright.com
Q1 Q2 = rca_sontiges:XO: XO91 Series Oscillators Frequency Range 500 kHz to 125 MHz Supply voltage range 1.8, 2.5, 3.3 or 5.0 Volts Gibt es in der 3,3V Version bei Reichelt (XO91 #Wert) Datenblatt: http://www.reichelt.de/?;ACTION=7;LA=6;OPEN=0;INDEX=0;FILENAME=B400%252FXO91.pdf XO53 Series Oscillators Frequency Range 2.5 MHz to 125 MHz Supply voltage range 1.8, 2.5, 3.3 Volts Gibt es in der 3,3V Version bei Reichelt (XO53 #Wert)
R1-R4 R7 R10 R12-R23 R25 R29 R33 = rcl:R-EU_: RESISTOR, European symbol
RN1-RN4 = resistor-dil:4R-N: Array Chip Resistor Source: RS Component / Phycomp
S1 = rca_sontiges:10-XX*: OMRON SWITCH
SJ2 SJ3 = rca_sontiges:SJ2W: SMD solder JUMPER
SJ4 = jumper:SJ: SMD solder JUMPER
SJ5 = rca_sontiges:SJ: SMD solder JUMPER
U1 = xilinx_devices:XC3S50AVQ100: Xilinx FPGA: XC3S50AVQ100
X3 = con-cypressindustries:MINI-USB-SCHIELD-: MINI USB-B Conector Source: www.cypressindustries.com

## Board
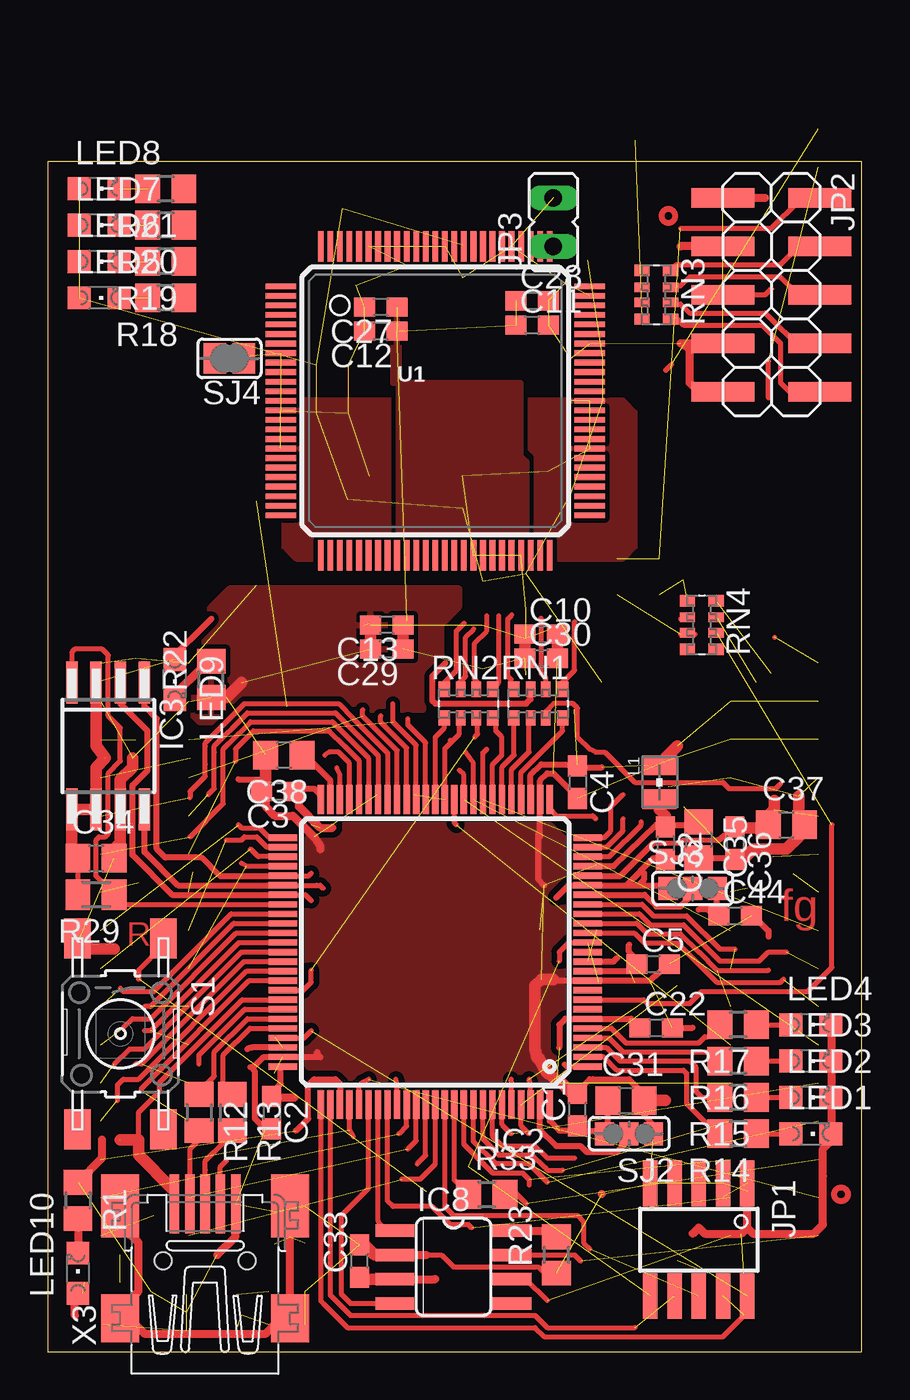
[diagram p7: board, top side]
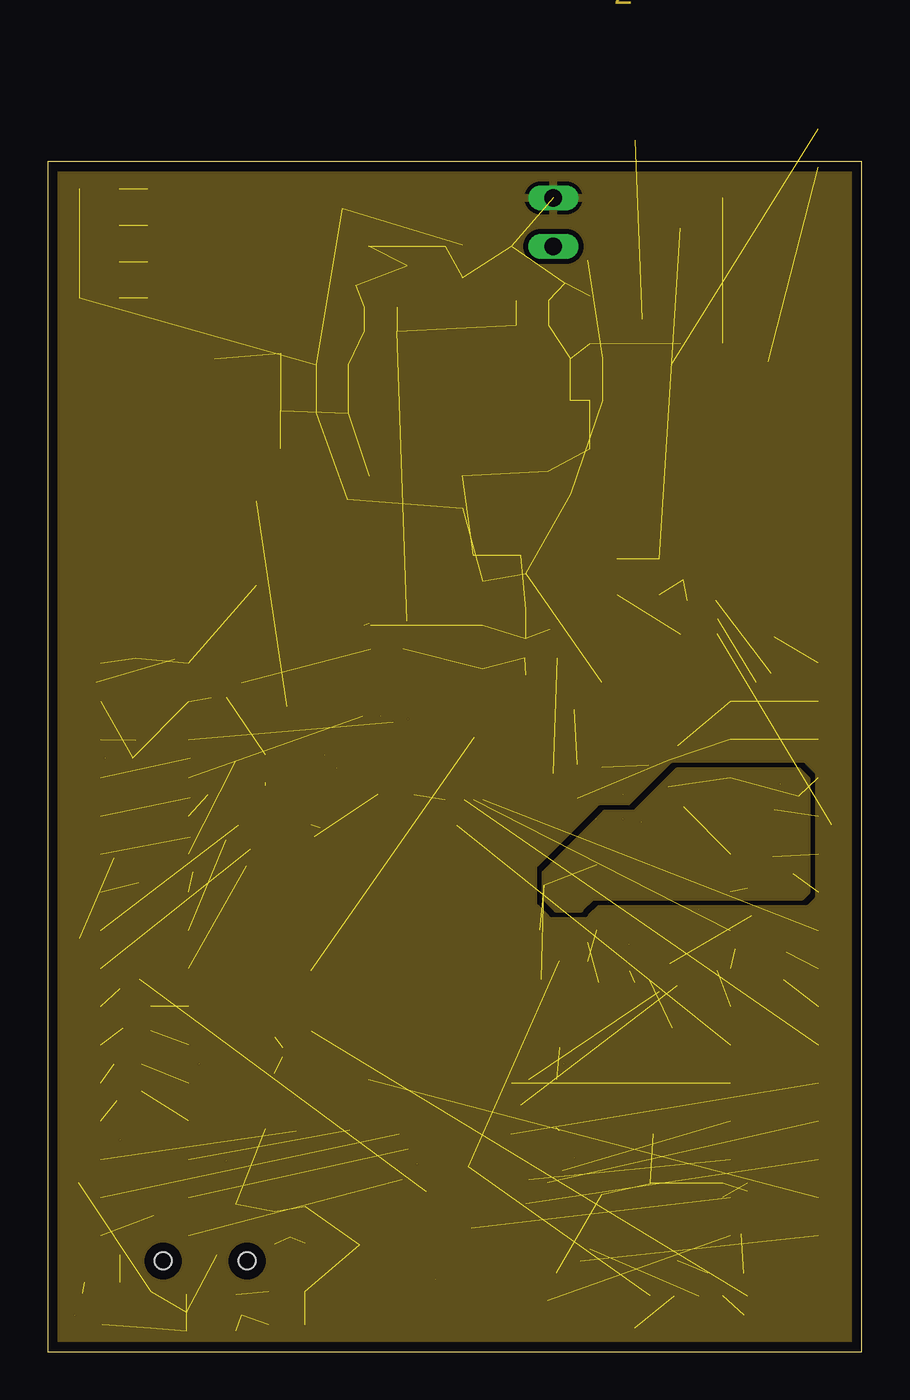
[diagram p8: board, inner layer GND]
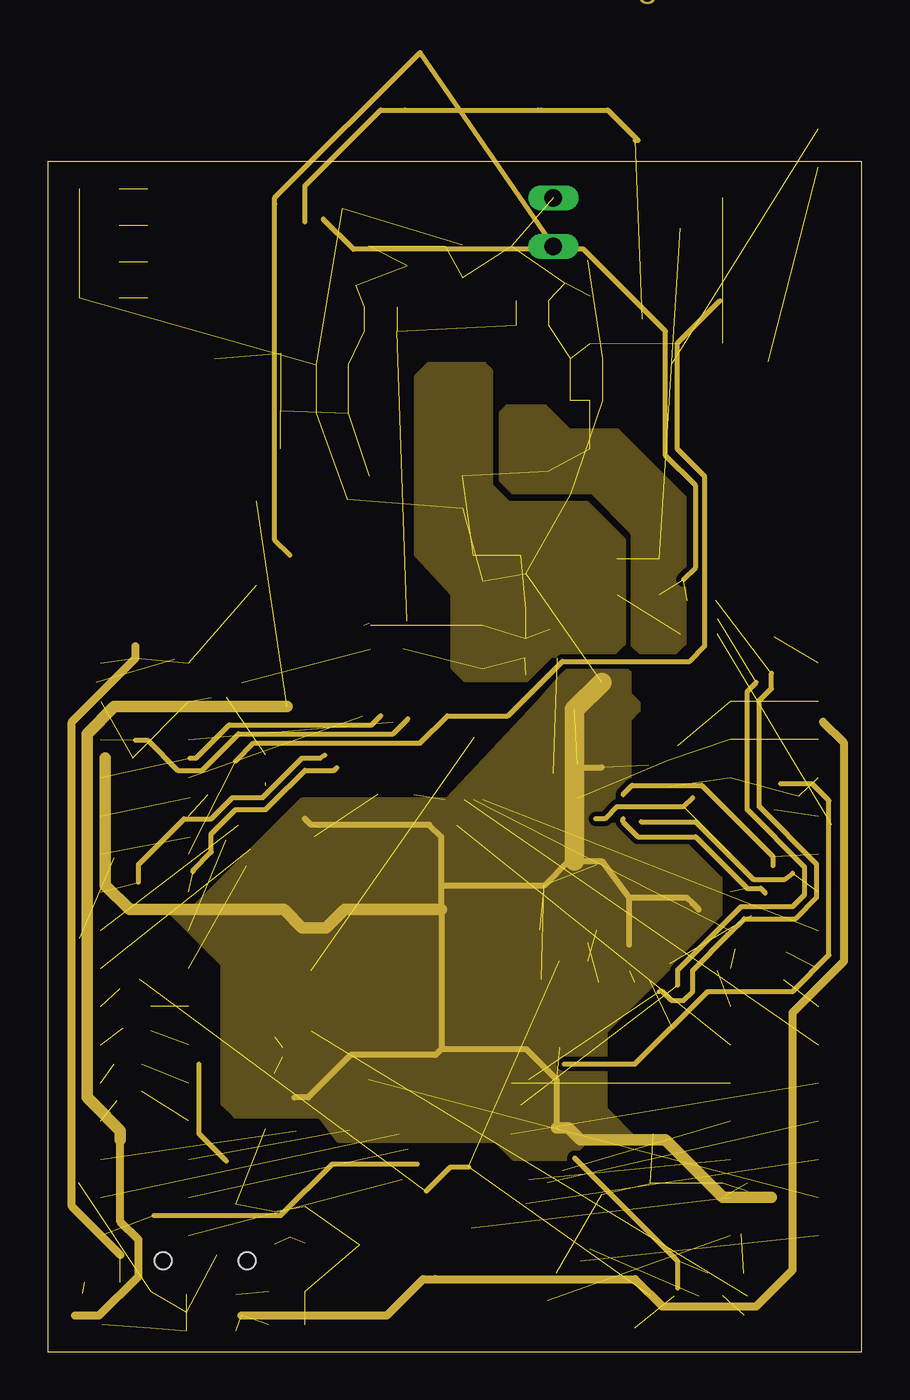
[diagram p9: board, inner layer Route15]
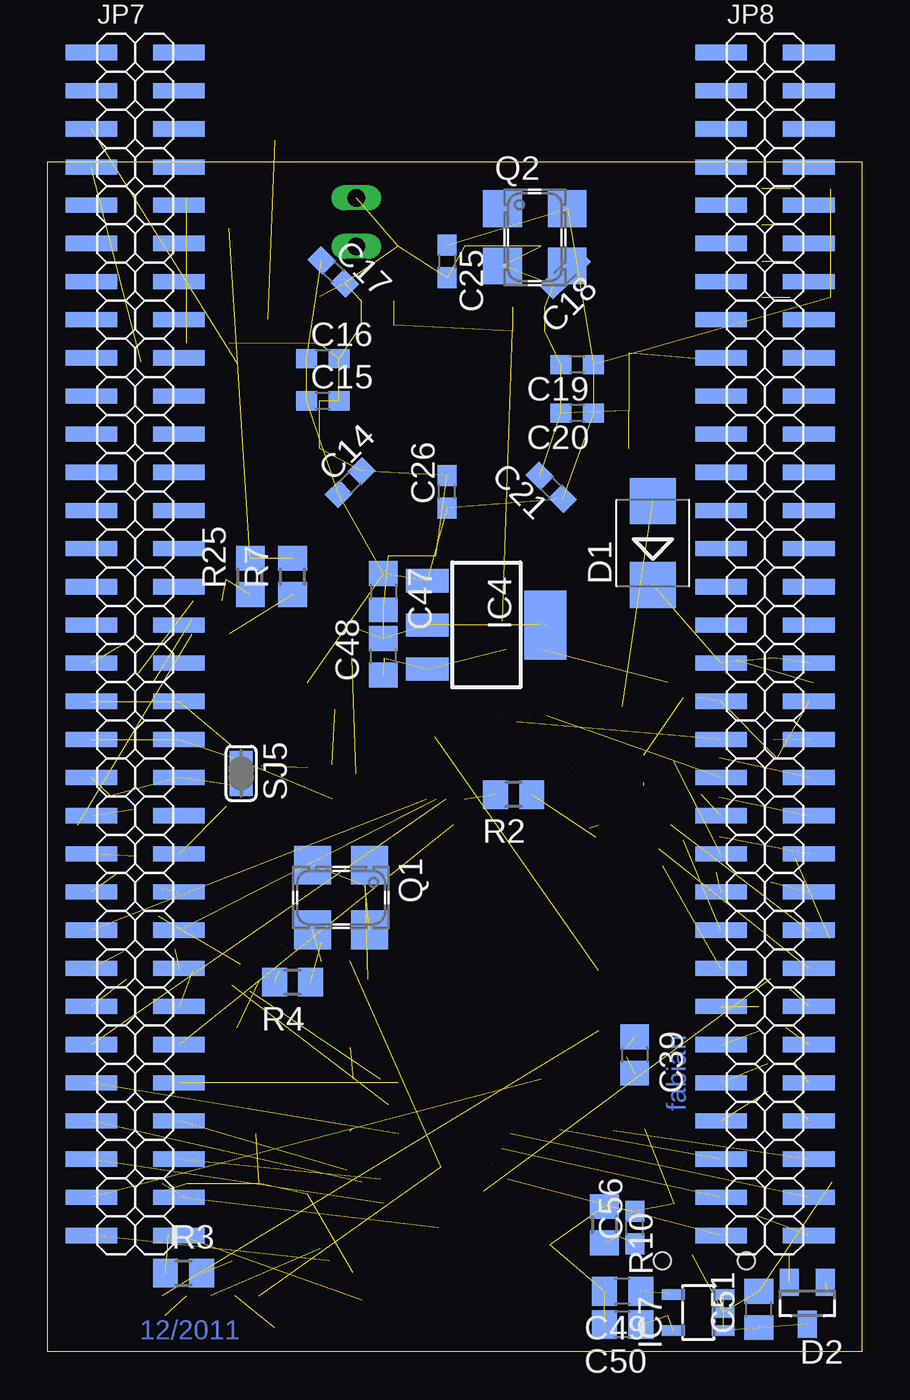
[diagram p10: board, bottom side, seen from below]

Size 42.68 x 62.38 mm. Coordinates in mm from the lower left corner, seen from the top.
Outline: 0,0 42.68,0 42.68,62.38 0,62.38 0,0
Copper layers (1+2*15+16): Top 0.035mm / dielectric 1.5mm / GND 0.035mm / dielectric 0.15mm / Route15 0.035mm / dielectric 0.2mm / Bottom 0.035mm
Design rules "PCB-POOL *": minimum track width 6mil, minimum drill 12mil, track to track 6mil, track to pad 6mil, pad to pad 6mil, via to via 6mil, smd to smd 6mil, copper to edge 20mil, drill to drill 8mil, minimum pad ring 8mil, minimum via ring 6mil, stop-mask expansion 12mil, vias tented up to drill 12mil, thermal gap 8mil

### Footprints (pad centres in the part's own frame; a part is rotated, then mirrored left to right if it is on the bottom)
C0603 = smd 1.1 x 1: 1 -0.85,0; 2 0.85,0
C0805 = smd 1.3 x 1.5: 1 -0.95,0; 2 0.95,0
SMB = smd 2.4 x 2.4: A 2.2,0; C -2.2,0
SOT23 = smd 1 x 1.4: 1 -0.95,-1.1; 2 0.95,-1.1; 3 0,1.1
TQFP100 = smd 1.5 x 0.33: 1 -8,6; 2 -8,5.5; 3 -8,5; 4 -8,4.5; 5 -8,4; 6 -8,3.5; 7 -8,3; 8 -8,2.5; 9 -8,2; 10 -8,1.5; 11 -8,1; 12 -8,0.5; 13 -8,0; 14 -8,-0.5; 15 -8,-1; 16 -8,-1.5; 17 -8,-2; 18 -8,-2.5; 19 -8,-3; 20 -8,-3.5; 21 -8,-4; 22 -8,-4.5; 23 -8,-5; 24 -8,-5.5; 25 -8,-6; 51 8,-6; 52 8,-5.5; 53 8,-5; 54 8,-4.5; 55 8,-4; 56 8,-3.5; 57 8,-3; 58 8,-2.5; 59 8,-2; 60 8,-1.5; 61 8,-1; 62 8,-0.5; 63 8,0; 64 8,0.5; 65 8,1; 66 8,1.5; 67 8,2; 68 8,2.5; 69 8,3; 70 8,3.5; 71 8,4; 72 8,4.5; 73 8,5; 74 8,5.5; 75 8,6 | smd 0.33 x 1.5: 26 -6,-8; 27 -5.5,-8; 28 -5,-8; 29 -4.5,-8; 30 -4,-8; 31 -3.5,-8; 32 -3,-8; 33 -2.5,-8; 34 -2,-8; 35 -1.5,-8; 36 -1,-8; 37 -0.5,-8; 38 0,-8; 39 0.5,-8; 40 1,-8; 41 1.5,-8; 42 2,-8; 43 2.5,-8; 44 3,-8; 45 3.5,-8; 46 4,-8; 47 4.5,-8; 48 5,-8; 49 5.5,-8; 50 6,-8; 76 6,8; 77 5.5,8; 78 5,8; 79 4.5,8; 80 4,8; 81 3.5,8; 82 3,8; 83 2.5,8; 84 2,8; 85 1.5,8; 86 1,8; 87 0.5,8; 88 0,8; 89 -0.5,8; 90 -1,8; 91 -1.5,8; 92 -2,8; 93 -2.5,8; 94 -3,8; 95 -3.5,8; 96 -4,8; 97 -4.5,8; 98 -5,8; 99 -5.5,8; 100 -6,8
SO-08M = smd 0.6 x 2.2: 1 -1.905,-3.33; 2 -0.635,-3.33; 3 0.635,-3.33; 4 1.905,-3.33; 5 1.905,3.33; 6 0.635,3.33; 7 -0.635,3.33; 8 -1.905,3.33
SOT223 = smd 1.219 x 2.235: 1 -2.311,-3.099; 2 0,-3.099; 3 2.311,-3.099 | smd 3.6 x 2.2: 4 0,3.099
SOT23-5L = smd 0.55 x 1.2: 1 -0.95,-1.3; 2 0,-1.3; 3 0.95,-1.3; 4 0.95,1.3; 5 -0.95,1.3
SOIC-8 = smd 2.032 x 0.66: 1 -3.073,1.27; 2 -3.073,0; 3 -3.073,-1.27; 4 -3.073,-2.54; 5 3.073,-2.54; 6 3.073,-1.27; 7 3.073,0; 8 3.073,1.27
1365-10 = smd 0.76 x 2.4: 1 -2.54,-2.95; 2 -2.54,2.95; 3 -1.27,-2.95; 4 -1.27,2.95; 5 0,-2.95; 6 0,2.95; 7 1.27,-2.95; 8 1.27,2.95; 9 2.54,-2.95; 10 2.54,2.95
2X05SMD = smd 1.016 x 3.302: 1 -1.27,-3.81; 2 -1.27,1.27; 3 1.27,-3.81; 4 1.27,1.27; 5 3.81,-3.81; 6 3.81,1.27; 7 6.35,-3.81; 8 6.35,1.27; 9 8.89,-3.81; 10 8.89,1.27
JP1 = drill 0.914 long: 1 0,-1.27; 2 0,1.27
2X32M_SMD = smd 0.8 x 2.7: 1 -30,-2.3; 2 -30,2.3; 3 -28,-2.3; 4 -28,2.3; 5 -26,-2.3; 6 -26,2.3; 7 -24,-2.3; 8 -24,2.3; 9 -22,-2.3; 10 -22,2.3; 11 -20,-2.3; 12 -20,2.3; 13 -18,-2.3; 14 -18,2.3; 15 -16,-2.3; 16 -16,2.3; 17 -14,-2.3; 18 -14,2.3; 19 -12,-2.3; 20 -12,2.3; 21 -10,-2.3; 22 -10,2.3; 23 -8,-2.3; 24 -8,2.3; 25 -6,-2.3; 26 -6,2.3; 27 -4,-2.3; 28 -4,2.3; 29 -2,-2.3; 30 -2,2.3; 31 0,-2.3; 32 0,2.3; 33 2,-2.3; 34 2,2.3; 35 4,-2.3; 36 4,2.3; 37 6,-2.3; 38 6,2.3; 39 8,-2.3; 40 8,2.3; 41 10,-2.3; 42 10,2.3; 43 12,-2.3; 44 12,2.3; 45 14,-2.3; 46 14,2.3; 47 16,-2.3; 48 16,2.3; 49 18,-2.3; 50 18,2.3; 51 20,-2.3; 52 20,2.3; 53 22,-2.3; 54 22,2.3; 55 24,-2.3; 56 24,2.3; 57 26,-2.3; 58 26,2.3; 59 28,-2.3; 60 28,2.3; 61 30,-2.3; 62 30,2.3; 63 32,-2.3; 64 32,2.3
WE-KI_0805_B = smd 1.02 x 1.78: 1 -0.89,0; 2 0.89,0
CHIPLED_0805 = smd 1.2 x 1.2: A 0,-1.05; C 0,1.05
XO53 = smd 1.93 x 2.032: 1 -1.5,-1.7; 2 1.5,-1.7; 3 1.5,1.7; 4 -1.5,1.7
R0805 = smd 1.3 x 1.5: 1 -0.95,0; 2 0.95,0
M0805 = smd 1.3 x 1.6: 1 -0.95,0; 2 0.95,0
EXB38V = smd 0.6 x 0.8: 1 -1.275,-0.75; 4 1.275,-0.75; 5 1.275,0.75; 8 -1.275,0.75 | smd 0.5 x 0.8: 2 -0.4,-0.75; 3 0.4,-0.75; 6 0.4,0.75; 7 -0.4,0.75
B3F-10XX-SMD = smd 2.1 x 1.4: P1 -5,2.25; P2 5,2.25; P3 -5,-2.25; P4 5,-2.25
SJ_2S = smd 1 x 1.2: 1 -1.286,0; 2 0,0; 3 1.286,0
SJ = smd 1.168 x 1.6: 1 -0.762,0; 2 0.762,0
SJS = smd 1 x 1.2: 1 -0.683,0; 2 0.683,0
VQ100 = smd 1.6 x 0.3: 1 -8.1,6; 2 -8.1,5.5; 3 -8.1,5; 4 -8.1,4.5; 5 -8.1,4; 6 -8.1,3.5; 7 -8.1,3; 8 -8.1,2.5; 9 -8.1,2; 10 -8.1,1.5; 11 -8.1,1; 12 -8.1,0.5; 13 -8.1,0; 14 -8.1,-0.5; 15 -8.1,-1; 16 -8.1,-1.5; 17 -8.1,-2; 18 -8.1,-2.5; 19 -8.1,-3; 20 -8.1,-3.5; 21 -8.1,-4; 22 -8.1,-4.5; 23 -8.1,-5; 24 -8.1,-5.5; 25 -8.1,-6; 51 8.1,-6; 52 8.1,-5.5; 53 8.1,-5; 54 8.1,-4.5; 55 8.1,-4; 56 8.1,-3.5; 57 8.1,-3; 58 8.1,-2.5; 59 8.1,-2; 60 8.1,-1.5; 61 8.1,-1; 62 8.1,-0.5; 63 8.1,0; 64 8.1,0.5; 65 8.1,1; 66 8.1,1.5; 67 8.1,2; 68 8.1,2.5; 69 8.1,3; 70 8.1,3.5; 71 8.1,4; 72 8.1,4.5; 73 8.1,5; 74 8.1,5.5; 75 8.1,6 | smd 0.3 x 1.6: 26 -6,-8.1; 27 -5.5,-8.1; 28 -5,-8.1; 29 -4.5,-8.1; 30 -4,-8.1; 31 -3.5,-8.1; 32 -3,-8.1; 33 -2.5,-8.1; 34 -2,-8.1; 35 -1.5,-8.1; 36 -1,-8.1; 37 -0.5,-8.1; 38 0,-8.1; 39 0.5,-8.1; 40 1,-8.1; 41 1.5,-8.1; 42 2,-8.1; 43 2.5,-8.1; 44 3,-8.1; 45 3.5,-8.1; 46 4,-8.1; 47 4.5,-8.1; 48 5,-8.1; 49 5.5,-8.1; 50 6,-8.1; 76 6,8.1; 77 5.5,8.1; 78 5,8.1; 79 4.5,8.1; 80 4,8.1; 81 3.5,8.1; 82 3,8.1; 83 2.5,8.1; 84 2,8.1; 85 1.5,8.1; 86 1,8.1; 87 0.5,8.1; 88 0,8.1; 89 -0.5,8.1; 90 -1,8.1; 91 -1.5,8.1; 92 -2,8.1; 93 -2.5,8.1; 94 -3,8.1; 95 -3.5,8.1; 96 -4,8.1; 97 -4.5,8.1; 98 -5,8.1; 99 -5.5,8.1; 100 -6,8.1
32005-201 = smd 3.1 x 0.5: 1 3,1.6; 2 3,0.8; 3 3,0; 4 3,-0.8; 5 3,-1.6 | smd 2.5 x 2: M1 -3,-4.45; M2 -3,4.45 | smd 3.3 x 2: M3 2.9,4.45; M4 2.9,-4.45 | hole 0.9: 0,2.2; 0,-2.2

### Placement (x,y rotation side)
C1  27.78,12.7 90 top
C2  11.75,12.54 270 top
C3  12.06,29.37 180 top
C4  27.78,29.84 270 top
C5  31.75,20.32 0 top
C10  25.88,37.62 0 top
C11  25.4,53.82 0 top
C12  17.46,53.5 180 top
C13  17.78,38.1 180 top
C14  26.83,45.56 45 bottom
C15  28.26,49.85 0 bottom
C16  28.26,52.07 0 bottom
C17  27.72,56.61 315 bottom
C18  15.56,56.52 225 bottom
C19  14.92,51.75 180 bottom
C20  14.92,49.21 180 bottom
C21  16.29,45.31 135 bottom
C22  31.91,16.99 0 top
C25  21.75,57.15 270 bottom
C26  21.75,45.09 90 bottom
C27  17.46,54.77 180 top
C28  25.4,55.09 0 top
C29  17.78,36.83 180 top
C30  25.88,36.35 0 top
C31  30.32,13.18 0 top
C32  32.38,26.67 270 top
C33  16.35,4.76 90 top
C34  2.54,25.88 0 top
C35  34.13,26.83 270 top
C36  36.04,26.67 270 top
C37  38.73,27.62 0 top
C38  12.38,31.27 180 top
C39  11.91,15.56 270 bottom
C44  36.04,22.86 0 top
C47  25.08,39.85 270 bottom
C48  25.08,36.43 90 bottom
C49  12.54,3.17 180 bottom
C50  12.54,1.43 180 bottom
C51  5.4,2.22 90 bottom
C56  11.91,6.51 90 bottom
D1  10.95,42.39 90 bottom
D2  2.86,2.54 180 bottom
IC2  20.32,20.95 180 top
IC3  3.17,31.75 180 top
IC4  19.68,38.1 270 bottom
IC7  8.57,2.06 90 bottom
IC8  21.27,5.08 0 top
JP1  34.13,5.87 180 top
JP2  39.21,59.21 270 top
JP3  26.51,59.21 0 top
JP7  38.1,38.1 270 bottom
JP8  5.08,38.1 270 bottom
L1  32.07,29.84 270 top
LED1  40.01,11.43 270 top
LED2  40.01,13.34 270 top
LED3  40.01,15.24 270 top
LED4  40.01,17.14 270 top
LED5  2.7,55.24 270 top
LED6  2.7,57.15 270 top
LED7  2.7,59.05 270 top
LED8  2.7,60.96 270 top
LED9  6.67,35.24 180 top
LED10  1.59,4.13 0 top
Q1  27.3,23.81 180 bottom
Q2  17.14,58.42 270 bottom
R1  1.59,7.94 270 top
R2  18.26,29.21 180 bottom
R3  35.56,4.13 0 bottom
R4  29.84,19.37 180 bottom
R7  29.84,40.64 90 bottom
R10  13.49,6.67 270 bottom
R12  7.94,12.54 270 top
R13  9.68,12.54 270 top
R14  36.2,11.43 180 top
R15  36.2,13.34 180 top
R16  36.2,15.24 180 top
R17  36.2,17.14 180 top
R18  6.19,55.24 180 top
R19  6.19,57.15 180 top
R20  6.19,59.05 180 top
R21  6.19,60.96 180 top
R22  8.57,35.24 90 top
R23  26.67,5.08 90 top
R25  32.07,40.64 90 bottom
R29  2.54,23.97 180 top
R33  23.02,8.26 0 top
RN1  25.72,33.97 0 top
RN2  22.07,33.97 0 top
RN3  31.91,55.4 270 top
RN4  34.29,38.1 270 top
S1  3.81,16.67 270 top
SJ2  30.48,11.43 180 top
SJ3  33.81,24.29 0 top
SJ4  9.53,52.07 180 top
SJ5  32.54,30.32 270 bottom
U1  20.32,49.85 0 top
X3  8.25,4.76 90 top

### Tracks (layer width: path | path; a pad name or v marks a point on that pad's centre or on a via)
!RESET  (4 unrouted)
  Top 0.254: IC2.14 27.33,21.45 26.83,20.95 26.83,20.48 | S1.P1 6.03,21.27 4.79,20.03 4.79,19.55 4.76,19.53
  Route15 0.254: 22.07,9.68 21.11,9.68 19.84,8.41
+2V5  (2 unrouted)
  Top 0.254: 33.18,58.9 37.94,58.9 39.37,60.33 40.32,60.33 JP2.2
  pour Route15 (isolate 0.254, rank 2): 23.81,45.4 23.81,49.21 24.13,49.53 26.04,49.53 27.3,48.26 29.84,48.26 33.34,44.77 33.34,37.15 32.7,36.51 31.27,36.51 30.64,37.15 30.64,43.02 28.57,45.09 24.13,45.09
+3V3  (33 unrouted)
  Top 0.254: R29.2 1.59,24.29 C34.1
  Top 0.305: IC2.11 30.54,19.95 C5.1 30.8,20.32 30.8,20.64 30.48,20.95 30.48,21.35 | IC2.50 14.22,29.27 13.97,29.53 13.18,29.53 C3.1 | C2.1 11.75,13.57 12.22,14.05 12.22,14.86 IC2.75 | IC2.28 25.32,30.24 25.88,30.8 27.68,30.8 C4.1 27.78,30.8 27.94,30.64 29.05,30.64 | C22.1 30.59,17.45 IC2.6 27.14,17.45 26.83,17.14 26.83,15.95 | IC2.100 26.32,12.1 26.83,11.59 27.46,11.59 27.73,11.85 C1.1 27.78,11.59 | 27.78,11.59 | 27.78,11.59 29.04,11.59 | 29.04,11.59 SJ2.3 | 29.04,11.59 29.37,11.59 C31.1 | SJ3.3 35.08,24.29 35.08,22.96 C44.1 35.03,23.02 34.77,23.02 34.61,23.18 34.13,23.18 | 6.83,36.67 7.46,37.31 8.57,38.42
  Top 0.406: C2.1 11.91,13.34 | 11.91,13.34 | 11.91,13.34 12.94,13.34 | 14.92,27.46 14.29,27.46 13.18,28.57 13.18,29.21 | 13.18,29.21 | 13.18,29.21 C3.1 | C3.1 | LED9.A 6.73,36.35 6.83,36.35 6.83,36.67
  Top 0.61: 3.02,31.11 2.54,30.64 IC3.6 IC3.5 1.27,26.51 1.43,26.35 C34.1 | 3.02,31.11 | 3.02,31.11 2.54,31.75 IC3.3 | L1.1 31.5,30.73 32.23,30.96 32.38,31.11 33.02,31.75
  Route15 0.305: 20.64,15.88 25.08,15.88 26.67,14.29 26.67,11.75 | 27.62,30.64 29.05,30.64 | 30.48,23.81 29.05,25.72 27.62,25.72 27.3,25.72 26.04,24.45 20.64,24.45 | 30.48,23.81 30.48,21.35 | 20.64,15.88 20.64,23.18 20.64,24.45 | 20.64,24.45 20.64,26.99 20,27.62 13.81,27.62 13.49,27.94 | 30.48,23.81 33.5,23.81 33.81,23.5 34.13,23.18 | 20.64,15.88 20.32,15.56 15.88,15.56 13.65,13.34 12.94,13.34
  Route15 0.61: 3.02,31.11 3.02,24.45 4.29,23.18 12.38,23.18 13.34,22.23 14.61,22.23 15.56,23.18 20.64,23.18 | 37.94,8.1 35.4,8.1 32.38,11.11 27.94,11.11 27.3,11.75 26.67,11.75
  Route15 1.016: 29.05,35.08 27.62,33.66 27.62,25.72
  pour Route15 (isolate 0.254, rank 2): 9.21,13.02 9.84,12.38 14.29,12.38 15.24,11.11 23.5,11.11 24.45,10.16 27.3,10.16 28.26,11.11 30.8,11.11 29.21,12.7 29.21,16.83 35.24,22.86 35.24,24.77 33.02,26.99 30.48,26.99 30.48,33.18 30.96,33.66 30.96,33.97 30.48,34.45 30.48,35.56 30.16,35.88 27.46,35.88 26.83,35.24 25.72,33.97 20.95,28.89 13.34,28.89 7.62,23.18 6.35,23.18 9.21,20.32
+5V  (3 unrouted)
  Top 0.406: IC8.3 20.32,3.81
  Top 0.61: IC8.3 16.45,3.81 C33.1
  Route15 0.406: 40.64,33.02 41.75,31.91 41.75,20.48 39.05,17.78 39.05,4.29 37.15,2.38 32.23,2.38 30.8,3.81 20.32,3.81 19.68,3.81 17.78,1.91 10.16,1.91
CAN1_RX
  Top 0.254: IC2.81 16.82,8.56 15.4,7.14 15.4,3.02 15.88,2.54 IC8.4
CAN1_TX
  Top 0.254: IC8.1 17.46,6.35 17.62,6.51 17.46,6.35 | 17.46,6.35 17.62,6.19 | 17.46,6.35 17.46,6.67 17.32,6.84 IC2.82
CAN-H  (1 unrouted)
  Top 0.254: IC8.7 27.62,5.08 27.94,4.76
CAN-L  (1 unrouted)
  Top 0.254: IC8.6 25.08,3.81 26.19,2.7
FLASH_CS
  Top 0.254: 3.49,24.45 3.49,24.57 2.9,24.57 2.54,24.92 2.54,26.83 2.7,26.99 3.02,26.99 3.17,27.15 3.17,30.32 3.81,30.96 3.81,32.7 3.17,33.34 3.17,36.51 2.86,36.83 1.43,36.83 1.27,36.67 IC3.4 | 3.49,24.45 3.02,24.45 3.93,23.45 IC2.58 | R29.1 3.49,24.45
GND  (72 unrouted)
  Top 0.254: R23.1 26.03,4.13 25.72,4.45 21.27,4.45 20.64,5.08 19.84,5.08 | JP2.5 37.62,55.4 37.94,55.72
  Top 0.305: C5.2 31.58,19.45 IC2.10 26.67,19.45 26.6,19.53 26.51,19.53 | C13.2 16.84,38.19 | C10.2 26.34,37.85 | C3.2 11.43,29.84 11.43,30 | 11.43,30 | 10,30 11.43,30 | 26.03,24.45 25.72,24.77 25.72,27.09 | 14.13,15.72 14.13,15.61 14.29,15.46 IC2.74 11.33,15.46 10.79,14.92 10.64,14.92 10.87,14.68 10.87,12.22 11.41,11.69 11.91,11.69 | 25.72,27.09 25.72,27.15 | 25.72,27.09 25.82,26.99 IC2.27 25.82,29.95 26.19,30.32 26.51,30.32 27.62,29.21 C4.2 | C22.2 33.81,16.99 | C1.2 27.94,13.81 28.42,14.29 | 28.42,14.29 | 28.42,14.29 28.57,14.29 30.48,14.29 30.96,13.81 30.96,13.49 C31.2 31.27,12.38 31.77,11.89 SJ2.1 | C44.2 36.99,22.86 37.78,22.07 37.78,21.75
  Top 0.406: C2.2 11.85,11.69 11.91,11.69 | X3.5 9.86,6.52 9.84,6.03 8.89,5.08 | 34.13,6.51 34.45,6.19 36.35,6.19 36.67,6.51 | 36.67,6.51 36.67,8.41 | 18.1,5.08 19.84,5.08 | R1.1 2.86,10.16 2.86,11.11 | 34.13,6.51 | 34.13,6.51 33.81,6.19 | 33.18,52.86 JP2.7 | 33.18,52.86 | JP2.1 35.88,60.48 37.62,60.48 | JP2.3 33.18,57.94 | 33.18,57.94 | 41.12,13.34 LED2.C 41.05,13.24 41.12,13.18 | 41.12,13.18 41.12,11.49 LED1.C 41.12,11.37 41.12,11.11 40.64,10.64 40.64,9.21 40.64,6.67 40.16,6.19 36.99,6.19 36.67,6.51 | 41.12,13.18 41.12,13.34 | 41.12,13.34 41.12,15.18 LED3.C 41.12,15.24 41.12,17.08 LED4.C | 14.29,26.35 14.29,26.51 13.97,26.99 12.86,28.1 11.91,28.1 11.43,28.57 11.43,29.69 | JP2.9 34.13,50.32 33.81,50.64 | 33.81,50.64 | 33.81,50.64 33.66,50.8 33.66,52.55 33.18,52.86 | 29.05,8.26
  Top 0.61: C29.2 C13.2 | C30.2 C10.2 | C34.2 3.33,26.19 3.81,26.67 IC3.7 3.81,30 4.45,30.64 4.45,31.11 | IC8.2 18.1,5.08 17.14,5.08 16.61,5.61 C33.2 | S1.P3 1.67,21.67 2.22,21.11 3.49,21.11 | C1.2 27.65,13.39 26.91,14.13 26.19,14.61 25.72,15.4 25.64,15.4 25.56,15.88 25.56,19.21 25.88,19.53 26.51,19.53 | C31.2 32.38,13.17 32.38,13.18 | 11.43,30 11.43,30.01 C38.2 | 10.16,35.08 9.37,34.29 R22.1
  pour Top (isolate 0.305): 13.65,26.99 14.29,27.62 26.35,27.62 26.99,26.99 26.99,14.92 26.35,14.29 14.29,14.29 13.65,14.92
  pour GND (isolate 0.254, rank 6): -1.27,73.66 27.94,73.66 27.94,70.17 33.66,70.17 33.66,73.66 43.18,73.66 43.18,-1.27 11.11,-1.27 5.4,-1.27 -1.27,-1.27
  pour Top (isolate 0.254, rank 2): 12.38,42.23 13.02,41.59 30.16,41.59 30.8,42.23 30.8,49.21 30.16,49.85 13.02,49.85 12.38,49.21
  pour Top (isolate 0.254): 14.29,33.66 19.68,33.66 20.64,34.61 20.64,38.1 21.59,39.05 21.59,40.01 9.53,40.01 7.62,38.1 7.62,33.34 7.94,33.02 13.65,33.02
GNDA  (3 unrouted)
  Top 0.305: 30.96,24.45 32.36,24.45 | 32.36,24.45 SJ3.1 | 32.36,24.45 32.36,24.63 | 30.33,24.45 IC2.20 27.31,24.45 26.67,23.81 | 30.33,24.45 31.75,25.88 32.01,25.88 C32.2 32.07,25.88 C35.2 | C35.2 | C35.2 35.82,25.88 C36.2 35.88,25.88 | 30.33,24.45 30.96,24.45 | 30.96,24.45 31.27,24.77 31.27,25.08
  Top 0.61: 35.88,25.88 36.51,25.88 36.99,26.35 38.73,26.35 39.37,26.99 39.37,27.47 C37.2 39.37,27.78 39.37,29.13 | 39.37,29.13 | 39.37,29.13
  pour GND (isolate 0.254): 29.21,28.26 26.04,25.08 26.04,23.81 26.67,23.18 27.94,23.18 28.57,23.81 39.53,23.81 39.85,24.13 39.85,30 39.37,30.48 33.02,30.48 30.8,28.26
N$1  (1 unrouted)
  Top 0.305: IC2.12 29.66,20.45 29.84,20.64
N$2  (2 unrouted)
  Route15 0.254: 14.45,59.37 16.03,57.78 28.1,57.78 32.38,53.5 32.38,46.99 33.97,45.4 33.97,41.12 33.34,40.48
N$3  (1 unrouted)
  Top 0.254: 33.18,37.62 33.93,37.62 RN4.3
N$4  (2 unrouted)
  Top 0.254: IC2.94 23.32,11.45 23.34,11.27 23.81,10.79 25.56,10.79 26.19,10.16 27.62,10.16
  Route15 0.254: 33.02,3.33 33.02,4.76 27.62,10.16
N$5
  Route15 0.254: JP3.1 19.53,68.1 11.91,60.48 11.91,60.17 11.91,42.55 12.7,41.75
N$7
  Top 0.254: 33.18,38.42 33.77,38.42 RN4.2
N$9  (1 unrouted)
  Route15 0.254: 13.49,59.21 13.49,61.12 17.46,65.09 18.73,65.09 25.72,65.09 25.88,65.09 29.37,65.09 30.96,63.5 | 30.96,63.5 30.8,63.5 30.96,63.5
N$12
  Top 0.254: JP2.6 39.37,55.4 38.42,56.36 33.66,56.36 33.18,55.88 32.73,55.88 RN3.7 | JP2.6
N$13
  Top 0.254: 37.78,54.29 39.37,52.7 40.32,52.7 JP2.8 | 37.78,54.29 | 37.78,54.29 37.62,54.45 33.66,54.45 33.18,54.93 32.73,54.93 RN3.6
N$14
  Top 0.254: JP2.10 38.89,50.32 38.42,50.8 38.42,52.86 37.47,53.82 33.34,53.82 33.02,54.13 32.7,54.13 RN3.5
N$15
  Top 0.254: JP2.4 39.37,57.94 38.42,56.99 32.97,56.99 RN3.8 | JP2.4
N$16
  Top 0.254: R12.2 8.1,11.27 7.46,10.64 7.46,8.88 X3.2
N$17
  Top 0.254: R13.2 9.68,11.75 9.69,11.75 R13.2 9.68,11.43 8.73,10.48 8.26,10 8.26,9.53 X3.3
N$18
  Top 0.254: R14.1 LED1.A
N$19
  Top 0.254: R15.1 LED2.A
N$20
  Top 0.254: R16.1 LED3.A
N$21
  Top 0.254: R17.1 LED4.A
N$22  (1 unrouted)
N$23  (1 unrouted)
N$24  (1 unrouted)
N$25  (1 unrouted)
N$26
  Top 0.406: LED9.C 6.67,34.45 8.1,35.88 8.26,35.88 R22.2
N$27
  Top 0.305: IC2.49 14.82,29.95 13.65,31.11 C38.1
N$28
  Top 0.305: IC2.99 25.82,11.64 26.67,10.79 27.94,10.79 28.26,10.48 29.84,10.48 30.48,11.11 SJ2.2
N$29  (1 unrouted)
  Top 0.305: IC2.73 10.72,15.96 10.48,15.88
N$30
  Top 0.305: IC2.19 31.29,23.95 31.91,23.34 33.18,23.34 33.81,23.97 SJ3.2
N$31
  Top 0.406: IC8.8 26.35,6.35 R23.2
N$33
  Top 0.406: R1.2 LED10.C
N$34
  Top 0.254: IC2.90 21.32,9 R33.1
N$36
  Top 0.305: IC2.22 29.68,25.45 31.91,27.62 | 31.91,27.62 32.38,27.62 | 32.38,27.62 32.44,27.68 C32.1 31.91,27.62 | 32.38,27.62 33.66,27.62 C35.1
  Top 0.61: C32.1 32.38,28.1 32.07,28.42 L1.2
N$40  (1 unrouted)
N$42  (2 unrouted)
  Top 0.406: X3.M2 3.81,2.22 | 3.81,2.22 4.76,3.17 4.76,5.71 4.13,6.35 4.13,7.34 X3.M3 | X3.M4 12.71,6.99 12.7,6.03 12.7,4.52 12.7,2.72 X3.M1 12.53,1.59 12.06,1.59 11.43,0.95 5.08,0.95 3.81,2.22
N$43  (3 unrouted)
P53
  Top 0.254: 20.16,34.13
  Top 0.305: 20.84,36.08 20.16,35.4 20.16,34.13 20.32,33.97 25.08,33.97 25.32,34.21 RN1.7
P55
  Top 0.254: 21.84,38.19 21.43,37.78 21.43,35.72 20.8,35.08 RN2.8
P56
  Top 0.254: 22.34,37.9 21.91,37.47 21.91,35.4 21.59,35.08 21.59,34.8 RN2.7
P58
  Top 0.254: 23.02,38.58 23.02,37.78 22.38,37.15 22.38,35.24 22.54,35.08 22.54,34.8 RN2.6
P59
  Top 0.254: 23.65,38.58 23.65,35.08 23.5,34.92 23.5,34.73 23.49,34.72 RN2.5
P60
  Top 0.254: 24.34,38.63 24.13,38.42 24.13,35.4 24.29,35.24 24.29,34.8 24.36,34.72 RN1.8
P63
  Top 0.254: 25.84,38.45 25.88,38.42 25.88,35.56 26.11,35.32 RN1.6
P65
  Top 0.254: 27.62,38.26 27.62,35.72 26.99,35.08 RN1.5
P73  (1 unrouted)
  Top 0.254: 38.1,37.47
P105  (1 unrouted)
  Top 0.254: 37.78,50.01 37.78,51.91
P108  (1 unrouted)
  Top 0.254: 32.38,51.44 32.7,51.75
PA0  (2 unrouted)
  Top 0.254: IC2.23 29.45,25.95 31.11,27.62 31.11,27.78
  Route15 0.254: 39.05,25.08 38.66,24.77 36.99,24.77 33.97,27.78 31.11,27.78
PA1  (2 unrouted)
  Top 0.254: IC2.24 29.31,26.45 30.16,27.3 30.16,27.94
  Route15 0.254: 37.39,24.29 37.62,24.05 | 37.39,24.29 | 37.39,24.29 36.67,24.29 33.97,26.99 30.96,26.99 30.16,27.78 30.16,27.94
PA2  (2 unrouted)
  Top 0.254: IC2.25 29.18,26.95 29.53,27.3 29.53,27.46 29.53,27.78 29.53,27.94 29.53,28.57 30.16,29.21
  Route15 0.254: 34.29,29.69 38.02,25.96 38.02,25.48 | 34.29,29.69 | 34.29,29.69 30.64,29.69 30.16,29.21 | 30.16,29.21
PA3  (2 unrouted)
  Top 0.254: IC2.26 26.32,28.45 26.67,28.1 28.57,28.1 28.73,27.94
  Route15 0.254: 28.73,27.94 29.21,27.94 29.84,28.57 32.7,28.57 33.34,28.57 33.81,29.05
PA8  (1 unrouted)
  Top 0.254: IC2.67 13.4,18.95 13.81,19.37 13.81,20 | 22.38,32.23 22.54,32.38 22.54,33.15 RN2.3
PB0  (1 unrouted)
  Top 0.254: IC2.35 21.82,30.25 21.59,30.48
PB1  (1 unrouted)
  Top 0.254: IC2.36 21.32,27.73 21.43,27.62
PB2  (1 unrouted)
  Top 0.254: IC2.37 20.82,31.61 21.11,31.91 | 21.11,31.91 21.59,32.38 21.59,33.15 RN2.2 | 21.11,31.91 21.11,32.07
PB4  (1 unrouted)
  Top 0.254: R33.2 24.61,8.26 25.08,7.78
PB5  (1 unrouted)
  Top 0.254: IC2.91 21.82,10.88 23.34,9.37 24.92,9.37 25.24,9.05 25.24,8.73
PB6  (1 unrouted)
  Top 0.254: IC2.92 22.32,11.02 23.5,9.84 25.24,9.84 25.72,9.37 25.88,9.21 26.19,8.89
PB7  (1 unrouted)
  Top 0.254: IC2.93 22.82,11.15 23.65,10.32 25.4,10.32 26.04,9.68 | 26.04,9.68 | 26.04,9.68 26.19,9.53 26.99,9.53
PB8  (1 unrouted)
  Top 0.254: IC2.95 23.82,11.9 24.29,11.43
PB9  (1 unrouted)
  Top 0.254: IC2.96 24.32,14.1 24.29,14.29
PB10  (2 unrouted)
  Top 0.254: 14.53,31.27 14.76,31.43 15.24,31.43 15.82,30.85 IC2.47
  Route15 0.254: 4.76,24.61 4.76,25.56 7.14,27.94 8.57,27.94 9.68,29.05 11.27,29.05 13.34,31.11 14.29,31.11 14.53,31.27
PB11  (2 unrouted)
  Top 0.254: IC2.48 15.32,30.24 15.15,30.61
  Route15 0.254: 7.62,25.16 7.62,25.24 8.57,26.19 8.57,27.15 9.84,28.42 11.43,28.42 11.91,28.89 | 11.91,28.89 | 11.91,28.89 13.34,30.32 | 13.34,30.32 | 13.34,30.32 13.49,30.48 15.02,30.48 15.15,30.6 15.15,30.61
PB12  (1 unrouted)
  Top 0.254: IC2.51 11.62,26.95 11.11,27.46 10.16,27.46 10,27.62
PB13  (1 unrouted)
  Top 0.254: IC2.52 11.49,26.45 10.95,26.99 10.32,26.99 10.16,26.83 9.37,26.83
PB14  (1 unrouted)
  Top 0.254: IC2.53 11.03,25.95 10.64,26.35
PB15  (1 unrouted)
  Top 0.254: IC2.54 10.42,25.45 10.16,25.62
PC0  (1 unrouted)
  Top 0.254: IC2.15 30.75,21.95 31.27,21.43 33.02,21.43 35.08,19.37 38.42,19.37 38.58,19.53
PC1  (1 unrouted)
  Top 0.254: IC2.16 30.89,22.45 31.43,21.91 33.18,21.91 34.13,20.95 35.08,20 37.78,20
PC2  (1 unrouted)
  Top 0.254: IC2.17 31.02,22.95 31.59,22.38 33.34,22.38 35.24,20.48 37.31,20.48 37.78,20.95 38.58,20.95 38.73,20.95
PC3  (1 unrouted)
  Top 0.254: IC2.18 31.16,23.45 31.75,22.86 33.5,22.86 35.24,21.11 36.04,21.11
PC4  (1 unrouted)
  Top 0.254: IC2.33 22.82,31.39 23.02,31.59
PC5  (1 unrouted)
  Top 0.254: IC2.34 22.32,30.86 21.91,31.43
PC6  (1 unrouted)
  Top 0.254: IC2.63 10.16,20.95 5.08,15.88 4.29,15.88 3.49,15.08
PC7  (1 unrouted)
  Top 0.254: IC2.64 10.29,20.45 4.92,15.08 4.6,15.08
PC8  (1 unrouted)
  Top 0.254: IC2.65 10.43,19.95 4.76,14.29 | 4.76,14.29 | 4.76,14.29 3.97,14.29 3.65,13.97 3.65,13.18
PC9  (1 unrouted)
  Top 0.254: IC2.66 10.56,19.45 5.24,14.13 4.92,13.81 4.92,13.65 | 4.92,13.65
PC10  (1 unrouted)
  Top 0.305: IC2.78 15.32,14.05 15.08,14.29 13.97,14.29 13.65,13.97 13.65,12.22 13.02,11.59
PC11  (1 unrouted)
  Top 0.254: IC2.79 15.82,11.64 16.03,11.27
PC12  (1 unrouted)
  Top 0.254: IC2.80 16.32,13.94 16.51,14.13 | 16.51,14.13 | 16.51,14.13 16.83,14.29
PC14  (1 unrouted)
  Top 0.254: IC2.8 31.23,18.45 31.43,18.26 33.66,18.26 34.29,18.89 39.85,18.89 41.12,20.16 41.12,27.62 | RN4.6 35.12,37.62
PD2  (1 unrouted)
  Top 0.254: IC2.83 17.82,7.9 18.1,7.62 20.16,7.62 21.11,6.67 22.07,6.67 22.23,6.51
PD4  (1 unrouted)
  Top 0.254: IC2.85 18.82,11.84 18.41,11.43
PD5  (1 unrouted)
  Top 0.254: IC2.86 19.32,11.06 19.05,10.79 | 19.05,10.79 | 19.05,10.79 18.89,10.64
PD6  (2 unrouted)
  Top 0.254: IC2.87 19.82,10.29 19.53,10 19.37,9.84
  Route15 0.254: 5.56,7.14 12.22,7.14 14.92,9.84 19.37,9.84
PD7  (1 unrouted)
  Top 0.254: IC2.88 20.32,9.84 19.53,9.05 18.57,9.05
PD12  (1 unrouted)
  Top 0.254: IC2.59 9.62,22.95 5.56,18.89 3.97,18.89 3.81,19.05
PD13  (1 unrouted)
  Top 0.254: IC2.60 9.76,22.45 5.4,18.1 5.08,18.1
PD14  (1 unrouted)
  Top 0.254: IC2.61 9.89,21.95 5.4,17.46 4.45,17.46 3.97,16.99
PD15  (1 unrouted)
  Top 0.254: IC2.62 10.03,21.45 5.4,16.83 5.08,16.83
PE0  (2 unrouted)
  Top 0.254: IC2.97 24.82,11.85 25.24,11.43 | RN4.7 35.12,38.42
  Route15 0.254: 33.02,19.21 33.02,20 36.35,23.34 | 36.35,23.34 | 36.35,23.34 | 36.35,23.34 39.05,23.34 39.69,23.97 39.69,25.4 36.67,28.42 36.67,34.61 37.15,35.08 | 37.15,35.08
PE1  (2 unrouted)
  Top 0.254: IC2.98 25.32,14.05 25.24,14.29
  Route15 0.254: 32.07,18.89 32.23,18.89 32.7,18.41 33.34,18.41 33.81,18.89 33.81,20 35.72,21.91 36.51,22.7 39.21,22.7 40.32,23.81 40.32,25.56 37.31,28.57 37.31,34.13 37.94,34.77 37.94,35.56
PE2  (2 unrouted)
  Top 0.254: IC2.1 27.19,14.96 27.07,15.08 | 38.42,29.77 38.18,29.53 35.72,29.53 35.4,29.84 30.8,29.84 29.21,31.43 28.73,31.43 28.42,31.59 27.78,32.23 27.78,33.73 27.54,33.97 26.51,33.97 26.11,33.58 RN1.3 | 38.42,29.77
  Route15 0.254: 27.07,15.08 30.8,15.08 34.61,18.89 39.05,18.89 40.96,20.8 40.96,28.89 40.08,29.77 38.42,29.77
PE3
  Top 0.254: IC2.2 29.15,15.46 29.84,14.76 33.34,14.76 33.5,14.61 33.5,13.02 34.92,11.59 35.08,11.43 R14.2
PE4
  Top 0.254: IC2.3 29.29,15.96 30,15.24 33.66,15.24 33.97,14.92 33.97,13.65 34.29,13.34 R15.2
PE5
  Top 0.254: IC2.4 29.42,16.45 30.16,15.72 34.77,15.72 R16.2
PE6
  Top 0.254: IC2.5 29.56,16.95 30.32,16.19 34.13,16.19 34.45,16.51 34.61,16.51 R17.2
PE7
  Top 0.254: IC2.38 20.32,32.23 20.8,32.7 RN2.1
PE8  (2 unrouted)
  Top 0.254: IC2.39 19.82,31.93 18.89,32.86 18.89,33.18
  Route15 0.254: 18.89,33.18 18.1,32.38 10,32.38 8.1,30.48 6.83,30.48 5.24,32.07 4.6,32.07
PE9  (1 unrouted)
  Top 0.254: IC2.40 19.32,31.8 18.26,32.86 | 18.26,32.86 | 18.26,32.86 18.1,33.02 18.1,33.97
PE10  (2 unrouted)
  Top 0.254: IC2.41 18.82,31.66 17.46,33.02 17.46,33.34
  Route15 0.254: 7.46,31.11 7.78,31.11 9.53,32.86 16.99,32.86 17.46,33.34
PE11  (1 unrouted)
  Top 0.254: IC2.42 18.32,31.53 16.51,33.34 | 16.51,33.34 16.51,33.66 | 16.51,33.34
PE12  (1 unrouted)
  Top 0.254: IC2.43 17.82,31.39 16.03,33.18 | 16.03,33.18 15.24,33.97 10.32,33.97 9.21,32.86 9.05,32.7 8.26,31.91 | 16.03,33.18 | 8.26,31.91 8.26,31.75 8.26,30.8 8.26,30.16 7.46,29.37 7.46,29.05 | 8.26,31.91
PE13  (1 unrouted)
  Top 0.254: IC2.44 17.32,31.26 15.88,32.7 15.08,33.5 10.48,33.5 9.68,32.7 | 9.37,32.38 9.68,32.7 | 9.68,32.7 | 8.41,29.21 8.73,29.53 8.73,31.43 8.73,31.75 9.37,32.38 | 9.37,32.38
PE14  (1 unrouted)
  Top 0.254: IC2.45 16.82,31.12 15.72,32.23 15.4,32.54 14.92,33.02 10.64,33.02 9.53,31.91 | 7.46,26.99 9.21,28.73 9.21,31.59 9.53,31.91 | 9.53,31.91
PE15  (2 unrouted)
  Top 0.254: IC2.46 16.32,30.99 15.56,31.75 14.76,32.54 10.79,32.54 | 9.84,30.96 9.84,31.59 10.79,32.54 | 10.79,32.54
  Route15 0.254: 35.24,55.09 33.02,52.86 33.02,47.31 34.29,46.04 | 34.29,46.04 | 34.29,46.04 34.45,45.88 34.45,36.99 33.66,36.2 26.99,36.2 24.13,33.34 20.95,33.34 19.53,31.91 10.79,31.91 9.84,30.96
SD_CS
  Top 0.254: IC2.84 18.32,14.03 18.26,14.29
SPI1_MISO
  Top 0.254: IC2.31 23.82,30.65 24.45,31.27 RN1.1
SPI1_MOSI
  Top 0.254: IC2.32 23.32,30.78 23.81,31.27 23.81,32.23 23.5,32.54 23.5,33.22 RN2.4
SPI1_NSS
  Top 0.254: IC2.29 24.82,30.38 25.88,31.43 | 25.88,31.43 | 25.88,31.43 26.99,32.54 RN1.4
SPI1_SCK
  Top 0.254: IC2.30 24.32,30.51 25.24,31.43 25.24,33.15 | 25.24,33.15 | 25.24,33.15 RN1.2
TCK  (1 unrouted)
  Top 0.254: 36.51,1.91 35.4,0.79 26.04,0.79 25.56,1.27 15.72,1.27 14.45,2.54 14.32,2.67 IC2.76
TDI  (1 unrouted)
  Top 0.254: IC2.77 14.82,2.96 15.88,1.91 25.56,1.91 26.19,1.27 30.8,1.27
TDO  (1 unrouted)
  Top 0.254: IC2.89 20.82,7.6 21.27,7.14 27.78,7.14 28.1,6.83 28.1,5.71 28.42,5.4
TMS  (1 unrouted)
  Top 0.254: IC2.72 13.44,16.45 13.81,16.83
UART3_CK
  Top 0.254: IC2.57 13.51,23.95 13.81,23.65
  Top 0.305: IC2.57 6.53,23.95 4.45,26.04 4.45,29.69 5.24,30.48 5.24,32.54 3.81,33.97 IC3.2
UART3_RX
  Top 0.254: IC2.56 14.12,24.45 14.29,24.45 14.45,24.29
  Top 0.305: IC2.56 6.82,24.45 5.08,26.19 IC3.8
UART3_TX
  Top 0.254: IC2.55 13.68,24.95 13.81,25.08
  Top 0.305: IC3.1 5.08,33.81 5.71,33.18 5.71,26.35 6.16,25.91 8.06,25.91 9.02,24.95 IC2.55
USB_DM
  Top 0.254: IC2.70 10.47,17.45 8.73,15.72 8.73,14.45 8.26,13.97 8.26,13.34 8.1,13.34 R12.1
USB_DP
  Top 0.254: R13.1 9.53,13.65 9.21,13.97 9.21,15.56 10.61,16.95 IC2.71
USB_ID  (2 unrouted)
  Top 0.254: IC2.69 10.34,17.95 7.94,15.56 7.94,15.08 | X3.4 9.05,8.24 9.05,9.68 9.37,10 | 9.37,10 | 7.94,15.08
  Route15 0.254: 9.37,10 7.94,11.43 7.94,15.08
USB_VBUS  (4 unrouted)
  Top 0.254: IC2.68 10.2,18.45 5.87,14.13 5.87,13.65 4.76,12.54 4.76,11.11 | 6.51,8.57 6.67,8.41 X3.1
  Top 0.406: 1.81,3.08 LED10.A 1.43,2.92 1.43,1.91 | X3.1 6.67,7.75
  Top 0.61: 6.51,8.57 4.76,10.32 4.76,11.11 3.81,11.11
  Route15 0.406: 1.43,1.91 2.7,1.91 4.76,3.97 4.76,5.87 3.81,6.83 3.81,11.11
  Route15 0.61: 3.81,11.11 3.81,11.59 2.38,13.02 2.06,13.34 2.06,32.38 3.49,33.81 12.54,33.81
VCC  (4 unrouted)
  Route15 0.406: 4.6,36.99 4.6,36.35 1.27,33.02 1.27,7.62 3.81,5.08
VCCINT  (7 unrouted)
  Top 0.305: C13.1 18.84,38.31 | C10.1 24.84,37.65
  Top 0.61: C29.1 C13.1 | C30.1 C10.1
  pour Top (isolate 0.254): 18.41,40.64 18.41,53.98 18.1,54.29 18.1,50.8 24.77,50.8 24.77,46.99 25.08,46.67 25.08,40.64
  pour Route15 (isolate 0.254): 19.37,51.12 20,51.75 22.86,51.75 23.18,51.44 23.18,45.4 24.13,44.45 28.26,44.45 30.16,42.55 30.16,37.15 29.53,36.51 26.35,36.51 25.08,35.24 21.91,35.24 21.27,35.88 21.27,39.69 19.37,41.75
VREF  (1 unrouted)
  Top 0.254: 31.75,26.67 33.02,26.67 33.34,26.83 35.08,26.83
  Top 0.305: IC2.21 30.04,24.95 31.75,26.67 | 35.08,26.83 | 35.08,26.83 35.19,26.83 C36.1 35.93,27.52 36.2,27.78 | C37.1 37.62,27.78
  Top 0.61: C37.1 37.47,27.46 36.09,27.46 C36.1 | 37.62,27.78 37.62,27.94 38.1,28.42 38.1,28.89
(copper drawn outside any net)
  shapes: Top circle x2

### Text on the board
Top: fg | R
GND: 2
Route15: 3
Bottom: fabian | 12/2011